# Altium project TB-S5D5_v1.2.PrjPcb
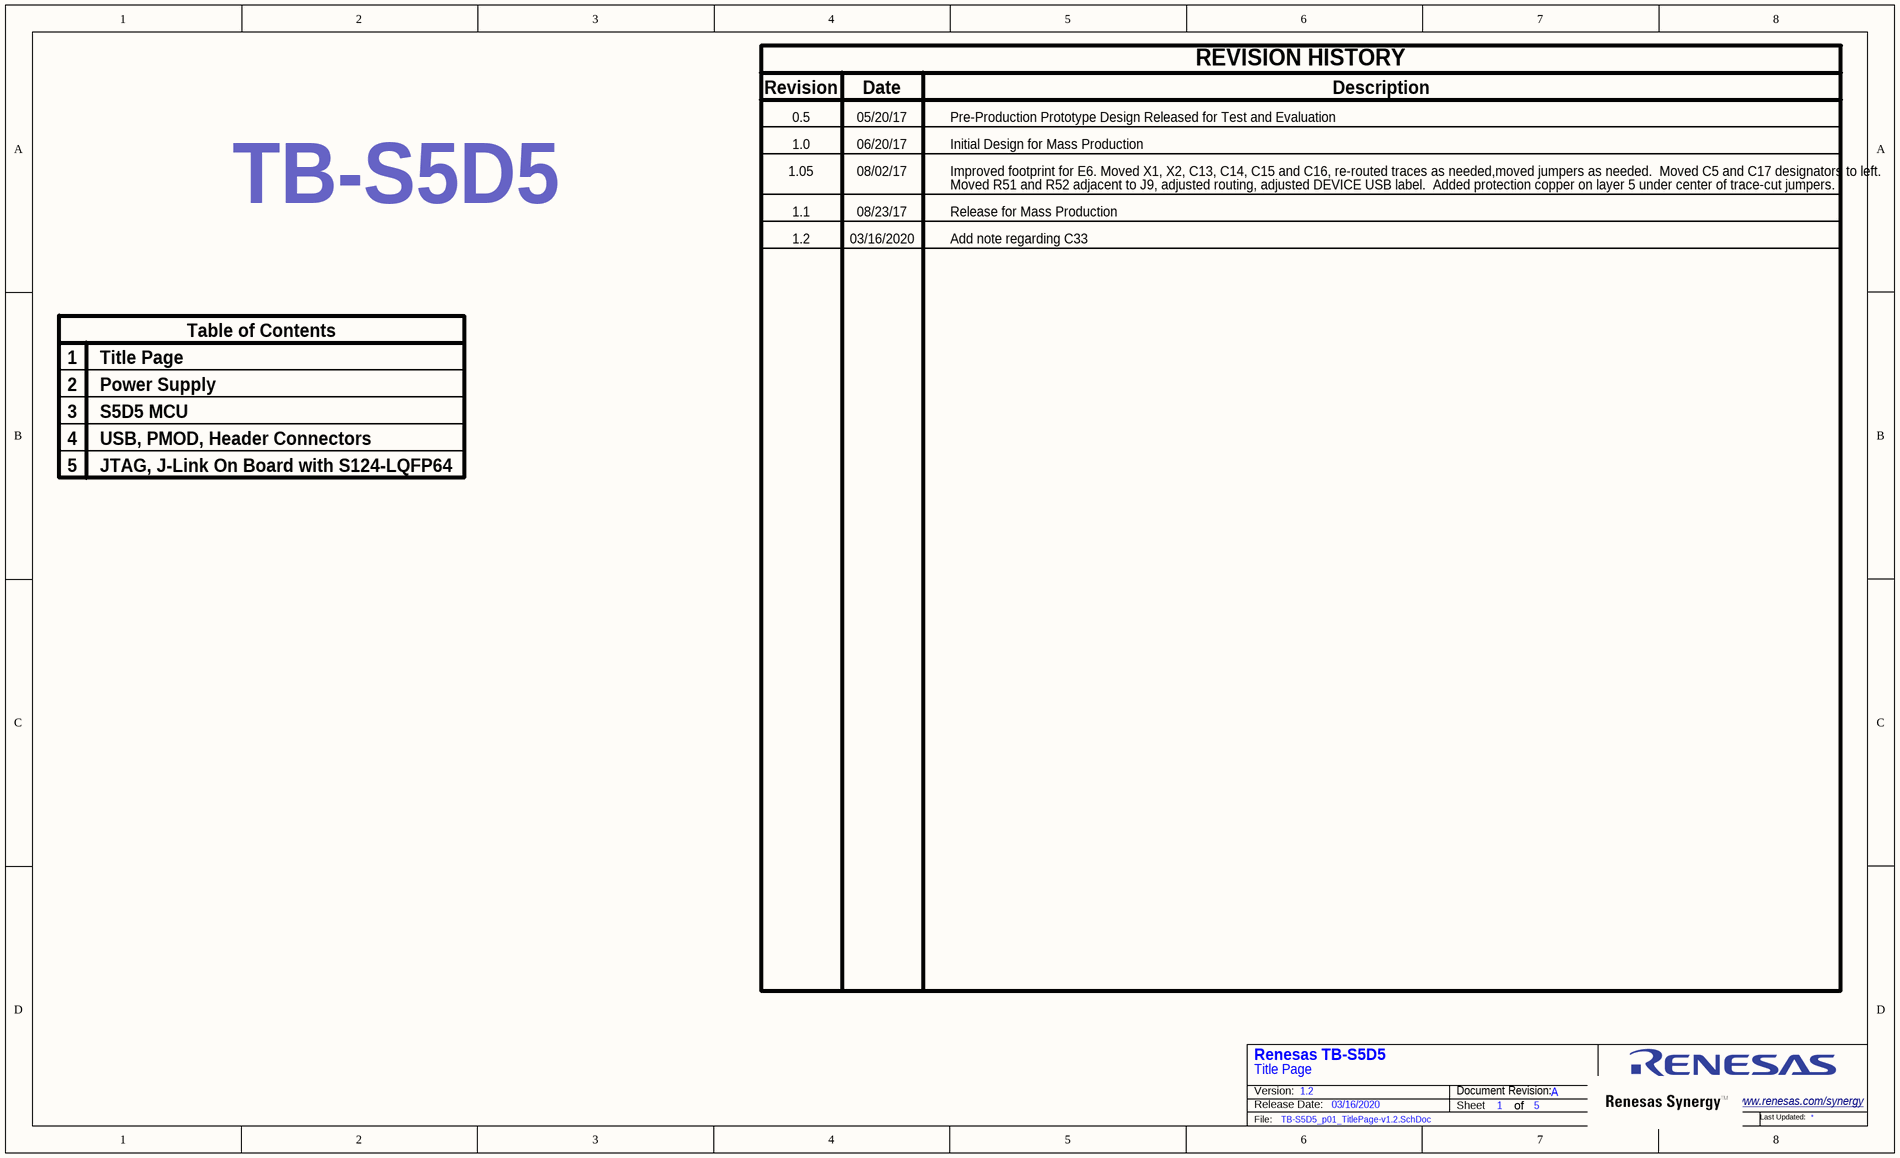
[diagram p0: TB-S5D5_p01_TitlePage-v1.2.SchDoc]
OUTFNAME_3DPDF: TB-S5D5_03-3D; OUTFNAME_OBOM: TB-S5D5_03_OutsideBOM; OUTFNAME_SCH: TB-S5D5_03; OUTFNAME_STEP: TB-S5D5_03-Model; PCB_REV: A; PCB_SPN: PCB-R01001-03; PCB_SYBD_PN: 00027; PROJECT_DATE: 03/16/2020; PROJECT_DESIG: TB-S5D5; PROJECT_DESIG_LC: tb-s5d5; PROJECT_NAME: Renesas TB-S5D5; PROJECT_VERSION: 1.2
5 sheets, 125 parts. Net scope: global (net labels, ports and power ports of the same name join across sheets).
Board file: TB-S5D5_v1.2.PcbDoc
Sheets:
  TB-S5D5_p01_TitlePage-v1.2.SchDoc
  TB-S5D5_p02_Power-v1.2.SchDoc
  TB-S5D5_p03_MCU-v1.2.SchDoc
  TB-S5D5_p04_Connectors-v1.2.SchDoc
  TB-S5D5_p05_JLink_OB-S124_QFP-v1.2.SchDoc

## Sheet TB-S5D5_p01_TitlePage-v1.2.SchDoc: Renesas DK-S3A7M
size Legal; Author: Jorge Amodio; Organization: Serious Integrated, Inc.; Address1: 145 s 79th Street; Address2: Suite 34; Address3: Chandler, AZ 85226; Address4: USA; DocumentNumber: 1; Revision: v2.0 PCB03; SheetNumber: 1; SheetTotal: 5; CompanyURL: www.seriousintegrated.com; ReleaseDate: 8/4/2015; Company Name: Renesas Electronics America; PageSetup: Record=PageOptions|CenterHorizontal=True|CenterVertical=True|PrintScale=1.00|XCorrection=1.00|YCorrection=1.00|PrintKind=1|BorderSize=5000000|LeftOffset=0|BottomOffset=0|Orientation=2|PaperLength=1000|PaperWidth=1000|Scale=100|PaperSource=7|PrintQuality=-4|MediaType=1|DitherType=10|PaperKind=A5 148x210mm|PrintScaleMode=1

### Notes on the sheet
- Revision
- Date
- REVISION HISTORY
- Description
- 0.5
- 1.0
- 05/20/17
- 06/20/17
- Pre-Production Prototype Design Released for Test and Evaluation
- Initial Design for Mass Production
- TB-S5D5
- 1.05
- 1.1
- 08/02/17
- 08/23/17
- Improved footprint for E6. Moved X1, X2, C13, C14, C15 and C16, re-routed traces as needed,moved jumpers as needed.  Moved C5 and C17 designators to left.
- Moved R51 and R52 adjacent to J9, adjusted routing, adjusted DEVICE USB label.  Added protection copper on layer 5 under center of trace-cut jumpers.
- Release for Mass Production
- 1.2
- 03/16/2020
- Add note regarding C33
- 1
- Title Page
- Table of Contents
- 2
- 3
- Power Supply
- S5D5 MCU
- 4
- 5
- USB, PMOD, Header Connectors
- JTAG, J-Link On Board with S124-LQFP64
- Version:
- Release Date:
- Document Revision:
- Sheet
- of
- www.renesas.com/synergy <http://www.renesas.com/synergy>
- File:
- 60
- Last Updated:

## Sheet TB-S5D5_p02_Power-v1.2.SchDoc: Renesas AE-CAP1-S3 Target Board
size Legal; Author: Jorge Amodio; Organization: Serious Integrated, Inc.; Address1: 145 s 79th Street; Address2: Suite 34; Address3: Chandler, AZ 85226; Address4: USA; DocumentNumber: 2; Revision: PCB02; SheetNumber: 2; SheetTotal: 5; CompanyURL: www.seriousintegrated.com; ReleaseDate: 8/12/2016; Version: v1.1; Company Name: Renesas Electronics America; PageSetup: Record=PageOptions|CenterHorizontal=True|CenterVertical=True|PrintScale=1.00|XCorrection=1.00|YCorrection=1.00|PrintKind=1|BorderSize=5000000|LeftOffset=0|BottomOffset=0|Orientation=2|PaperLength=1000|PaperWidth=1000|Scale=100|PaperSource=7|PrintQuality=-4|MediaType=1|DitherType=10|PaperKind=A5 148x210mm|PrintScaleMode=1
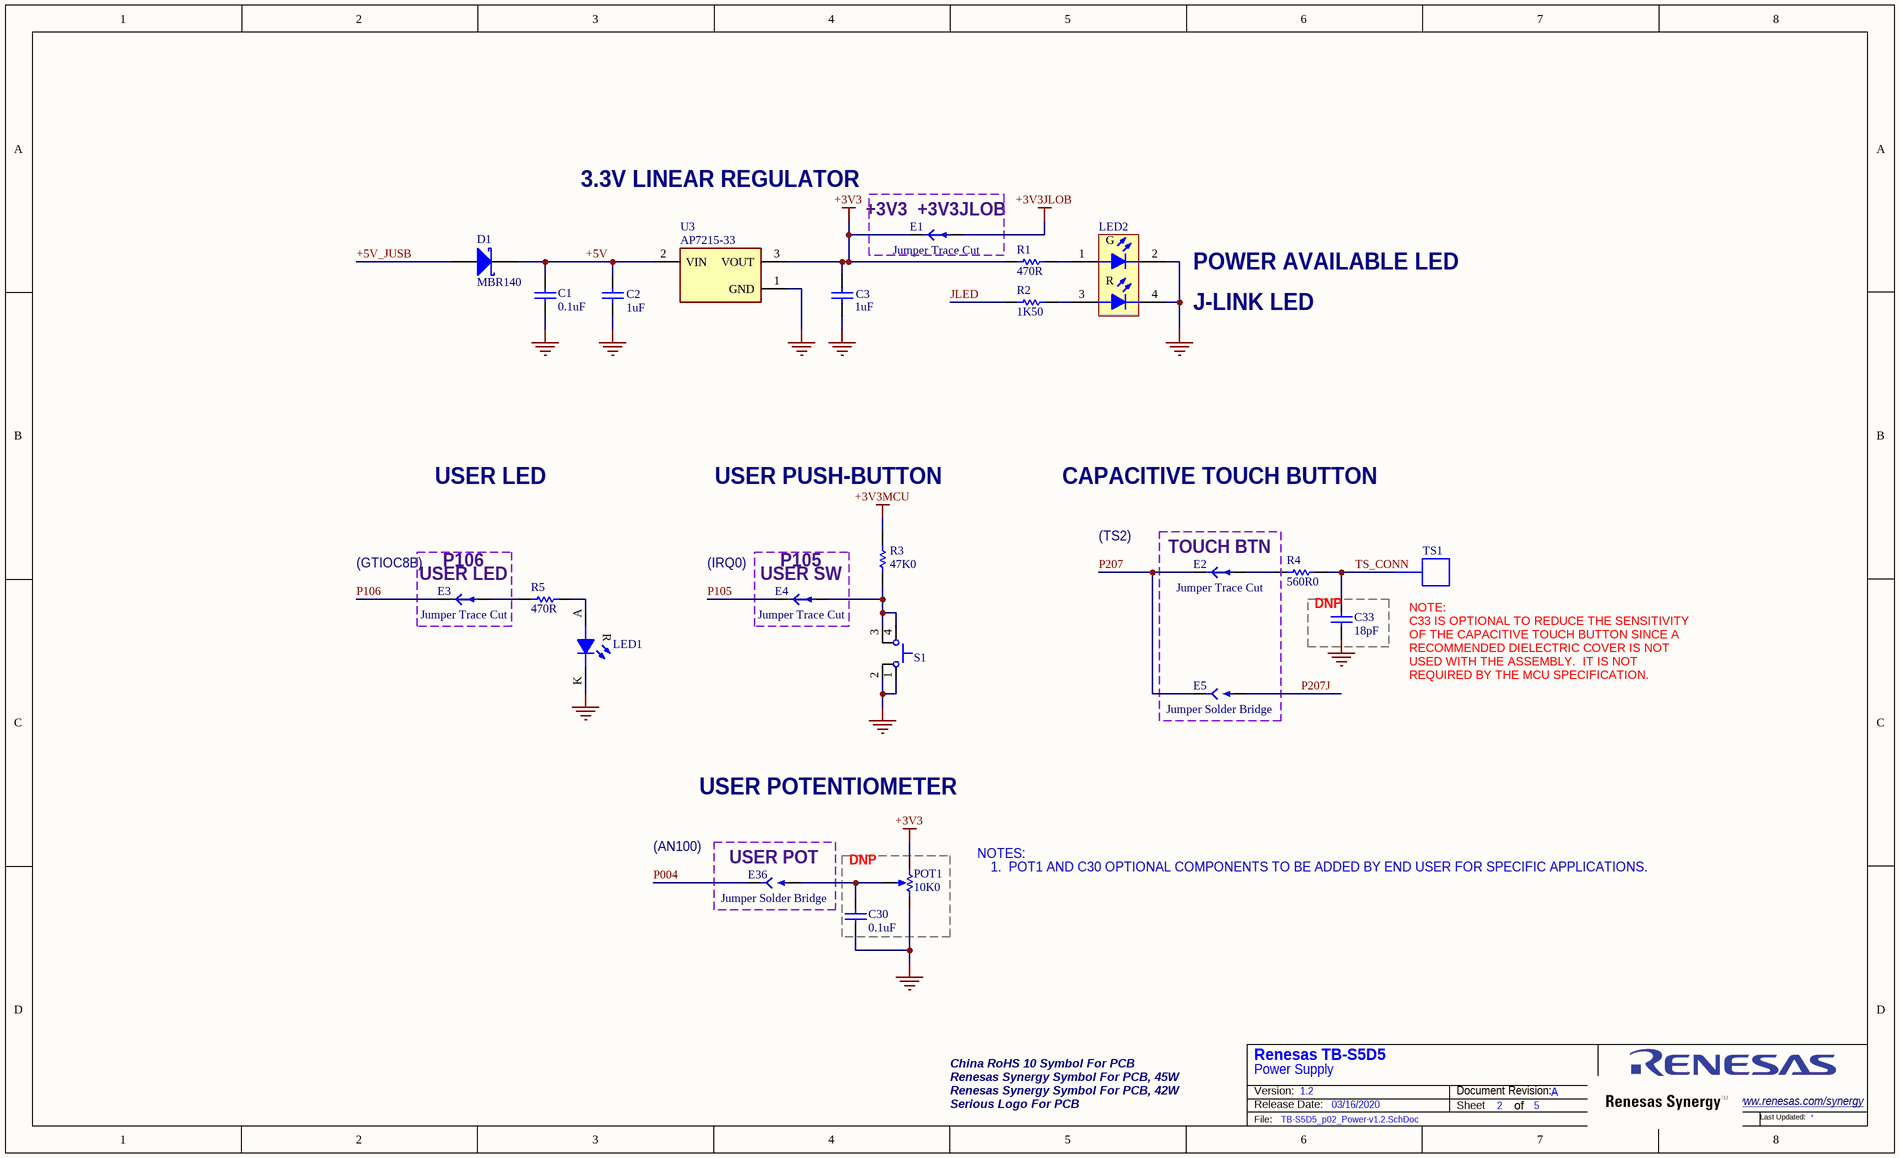
[diagram p1: TB-S5D5_p02_Power-v1.2.SchDoc]

### Parts
A_Logo1  This BOM is for Engineering Use Only, NOT FOR PURCHASE USE.  [_SeriousEngineering]  (value not drawn)
A_Symbol1  This Symbol Placed on PCB only.  [ChinaRoHS-7mm]  (value not drawn)  (no BOM)
A_Symbol2  This Symbol Placed on PCB only.  [RenesasSynergyLogo45x7]  (value not drawn)  (no BOM)
A_Symbol3  This Symbol Placed on PCB only.  [RenesasSynergyLogo42x7]  (value not drawn)  (no BOM)
C1  Capacitance: 0.1uF  [CAPC0603-01]  (hidden comment: CAP-000029-01)
C2  Capacitance: 1uF  [CAPC0402-01]  (hidden comment: CAP-000063-01)
C3  Capacitance: 1uF  [CAPC0402-01]  (hidden comment: CAP-000063-01)
C30  Capacitance: 0.1uF  [CAPC0603-01]  (hidden comment: CAP-000029-01)
C33  Capacitance: 18pF  [CAPC0603-01]  (hidden comment: CAP-000040-01)
D1  Display Name: MBR140  [ONSEMI_SOD-123LF]  (hidden comment: DIO-000012-01)
E1  Jumper Trace Cut  [E_PadsTraceCut0805]  (net tie, no BOM)
E2  Jumper Trace Cut  [E_PadsTraceCut0805]  (net tie, no BOM)
E3  Jumper Trace Cut  [E_PadsTraceCut0805]  (net tie, no BOM)
E4  Jumper Trace Cut  [E_PadsTraceCut0805]  (net tie, no BOM)
E5  Jumper Solder Bridge  [E_PadsSplit0805]  (no BOM)
E36  Jumper Solder Bridge  [E_PadsSplit0805]  (no BOM)
LED1  LED-000005-01  [LED_0603-RED]  (value not drawn)
LED2  LED-000001-01  [LED_DIALIGHT-598-8610]  (value not drawn)
POT1  Resistance: 10K0  [BOURNS_3352T]  (hidden comment: POT-000001-02)
R1  Resistance: 470R  [RESC0402-01]  (hidden comment: RES-000124-01)
R2  Resistance: 1K50  [RESC0402-01]  (hidden comment: RES-000140-01)
R3  Resistance: 47K0  [RESC0402-01]  (hidden comment: RES-000173-01)
R4  Resistance: 560R0  [RESC0603-01]  (hidden comment: RES-000206-01)
R5  Resistance: 470R  [RESC0402-01]  (hidden comment: RES-000124-01)
S1  SWT-000013-01  [SW_C&K_PTS645_43]  (value not drawn)
TS1  TOUCH_PAD_OL  [RENESAS_TSP_OL]  (value not drawn)  (no BOM)
U3  Display Name: AP7215-33  [SOT-89-3]  (hidden comment: ICN-000215-01)

### Blocks framed on the sheet
+3V3  +3V3JLOB: E1
TOUCH BTN: E2 E5
DNP: C33
USER POT: E36
DNP: C30 POT1

### Nets
+3V3: C3.2 E1.1(A) POT1.1 R1.1 U3.3(VOUT)
+3V3JLOB: E1.2(A)
+3V3MCU: R3.2
GND: C1.1 C2.1 C3.1 C30.1 C33.1 LED1.K LED2.2(K1) LED2.4(K2) POT1.3 S1.1 S1.2 U3.1(GND)
+5V: C1.2 C2.2 D1.K U3.2(VIN)
+5V_JUSB: D1.A
JLED: R2.1
P004: E36.1(A)
P105: E4.1(A)
P106: E3.1(A)
P207: E2.1(A) E5.1(A)
P207J: E5.2(A)
TS_CONN: C33.2 R4.2
NetC30_2: C30.2 E36.2(A) POT1.2
NetE2_2: E2.2(A) R4.1
NetE3_2: E3.2(A) R5.2
NetE4_2: E4.2(A) R3.1 S1.3 S1.4
NetLED1_A: LED1.A R5.1
NetLED2_1: LED2.1(A1) R1.2
NetLED2_3: LED2.3(A2) R2.2

### Notes on the sheet
- 3.3V LINEAR REGULATOR
- POWER AVAILABLE LED
- J-LINK LED
- USER LED
- USER PUSH-BUTTON
- CAPACITIVE TOUCH BUTTON
- (near E3) (GTIOC8B)
- (near E3) P106
- (near E4) (IRQ0)
- (near E4) P105
- (TS2)
- (near E3) USER LED
- (near E4) USER SW
- NOTE:
  C33 IS OPTIONAL TO REDUCE THE SENSITIVITY OF THE CAPACITIVE TOUCH BUTTON SINCE A RECOMMENDED DIELECTRIC COVER IS NOT USED WITH THE ASSEMBLY.  IT IS NOT REQUIRED BY THE MCU SPECIFICATION.
- USER POTENTIOMETER
- (AN100)
- NOTES:
- 1.  POT1 AND C30 OPTIONAL COMPONENTS TO BE ADDED BY END USER FOR SPECIFIC APPLICATIONS.
- Power Supply
- Version:
- Release Date:
- Document Revision:
- Sheet
- of
- www.renesas.com/synergy <http://www.renesas.com/synergy>
- File:
- 60
- Last Updated:
- (in symbol A_Serious_Engineering_Logo) Serious Logo For PCB
- (in symbol A_Symbol_ChinaRoHS07) China RoHS 10 Symbol For PCB
- (in symbol A_Symbol_RenesasSynergy-42x7) Renesas Synergy Symbol For PCB, 42W
- (in symbol A_Symbol_RenesasSynergy-45x7) Renesas Synergy Symbol For PCB, 45W
- (in symbol LED-000001-01) G; R
- (in symbol LED-000005-01) R

### Library data of the parts
A_Logo1 = A_Serious_Engineering_Logo: Combination disclaimer and Serious Integrated Design splash; Mfg Part Number: (none); Manufacturer: N/A
A_Symbol1 = A_Symbol_ChinaRoHS07: China RoHs Symbol Circle-7
A_Symbol2 = A_Symbol_RenesasSynergy-45x7: Renesas Synergy Logo, Std 45Wx7.4Hmm
A_Symbol3 = A_Symbol_RenesasSynergy-42x7: Renesas Synergy Logo, 42Wx6.8Hmm
C1 C30 = CAP-000029-01: Ceramic Chip Capacitor 0603 0.1uF 50V; Manufacturer: Samsung; Mfg Part Number: CL10B104KB8NNNC; Dialectric: X7R; Tolerance: 10%; Voltage: 50V; Package: 0603
C2 C3 = CAP-000063-01: Ceramic Chip Capacitor 0402 1uF 16V; Manufacturer: Samsung; Mfg Part Number: CL05A105KO5NNNC; Dialectric: X5R; Tolerance: 10%; Voltage: 16V; Package: 0402
C33 = CAP-000040-01: Ceramic Chip Capacitor 0603 18pF 50V; Manufacturer: Samsung; Mfg Part Number: CL10C180JB8NNNC; Dialectric: COG; Tolerance: 5%; Voltage: 50V; Package: 0603
D1 = DIO-000012-01: OnSemi Schottky Power Rectifier 40V 1A; Mfg Part Number: MBR140SFT1G; Manufacturer: OnSemi; Package: SOD-123FL; Voltage: 40V; Current: 1A
E1-E4 = E_JmpTraceCut: Pads on PCB with Trace Between for Cutting to isolate
E5 E36 = E_JmpSldrBridge: Pads on PCB with Narrow Gap to allow Solder Bridging
LED1 = LED-000005-01: Lite-On LED Red Clear 0603; Mfg Part Number: LTST-C191KRKT; Manufacturer: Lite-On; Package: 0603
LED2 = LED-000001-01: Dialight Bicolor LED Red/Green 1210; Mfg Part Number: 598-8610-207F; Manufacturer: Dialight; Package: 1210
POT1 = POT-000001-02: Bourns Single Turn Trimmer 10K0; Mfg Part Number: 3352T-1-103LF; Tolerance: 20%; Package: BOURNS_3355T; Manufacturer: Bourns
R1 R5 = RES-000124-01: Chip Resistor Thick Film 0402 470R 0.5% 1/16W; Manufacturer: Panasonic; Mfg Part Number: ERA-2AED471X; Package: 0402; Power: 1/16W; Tolerance: 0.5%
R2 = RES-000140-01: Chip Resistor Thick Film 0402 1K50 0.5% 1/16W; Manufacturer: Panasonic; Mfg Part Number: ERA-2AED152X; Package: 0402; Power: 1/16W; Tolerance: 0.5%
R3 = RES-000173-01: Chip Resistor Thick Film 0402 47K0 1% 1/10W; Manufacturer: Panasonic; Mfg Part Number: ERJ-2RKF4702X; Package: 0402; Power: 1/10W; Tolerance: 1%
R4 = RES-000206-01: Chip Resistor Thick Film 0603 560R0 1% 1/10W; Manufacturer: Panasonic; Mfg Part Number: ERJ-3EKF5600V; Package: 0603; Power: 1/10W; Tolerance: 1%; Serious P/N: RES-000206-01
S1 = SWT-000013-01: Push Button Switch 6 x 6mm 4.3mm High; Manufacturer: C&K; Mfg Part Number: PTS645SM43SMTR92 LFS; Serious P/N: SWT-000013-01
TS1 = TOUCH_PAD_OL: Renesas Touch Sense Pad Outline (for non-Pad use)
U3 = ICN-000215-01: LDO Regulator 3.3V 600mA; Manufacturer: Diodes; Mfg Part Number: AP7215-33YG-13; Package: SOT-89-3

## Sheet TB-S5D5_p03_MCU-v1.2.SchDoc: Renesas AE-CAP1-S3 Target Board
size Legal; Author: Jorge Amodio; Organization: Serious Integrated, Inc.; Address1: 145 s 79th Street; Address2: Suite 34; Address3: Chandler, AZ 85226; Address4: USA; DocumentNumber: 3; Revision: PCB02; SheetNumber: 3; SheetTotal: 5; CompanyURL: www.seriousintegrated.com; ReleaseDate: 8/12/2016; Version: v1.1; Company Name: Renesas Electronics America; PageSetup: Record=PageOptions|CenterHorizontal=True|CenterVertical=True|PrintScale=1.00|XCorrection=1.00|YCorrection=1.00|PrintKind=1|BorderSize=5000000|LeftOffset=0|BottomOffset=0|Orientation=2|PaperLength=1000|PaperWidth=1000|Scale=100|PaperSource=7|PrintQuality=-4|MediaType=1|DitherType=10|PaperKind=A5 148x210mm|PrintScaleMode=1
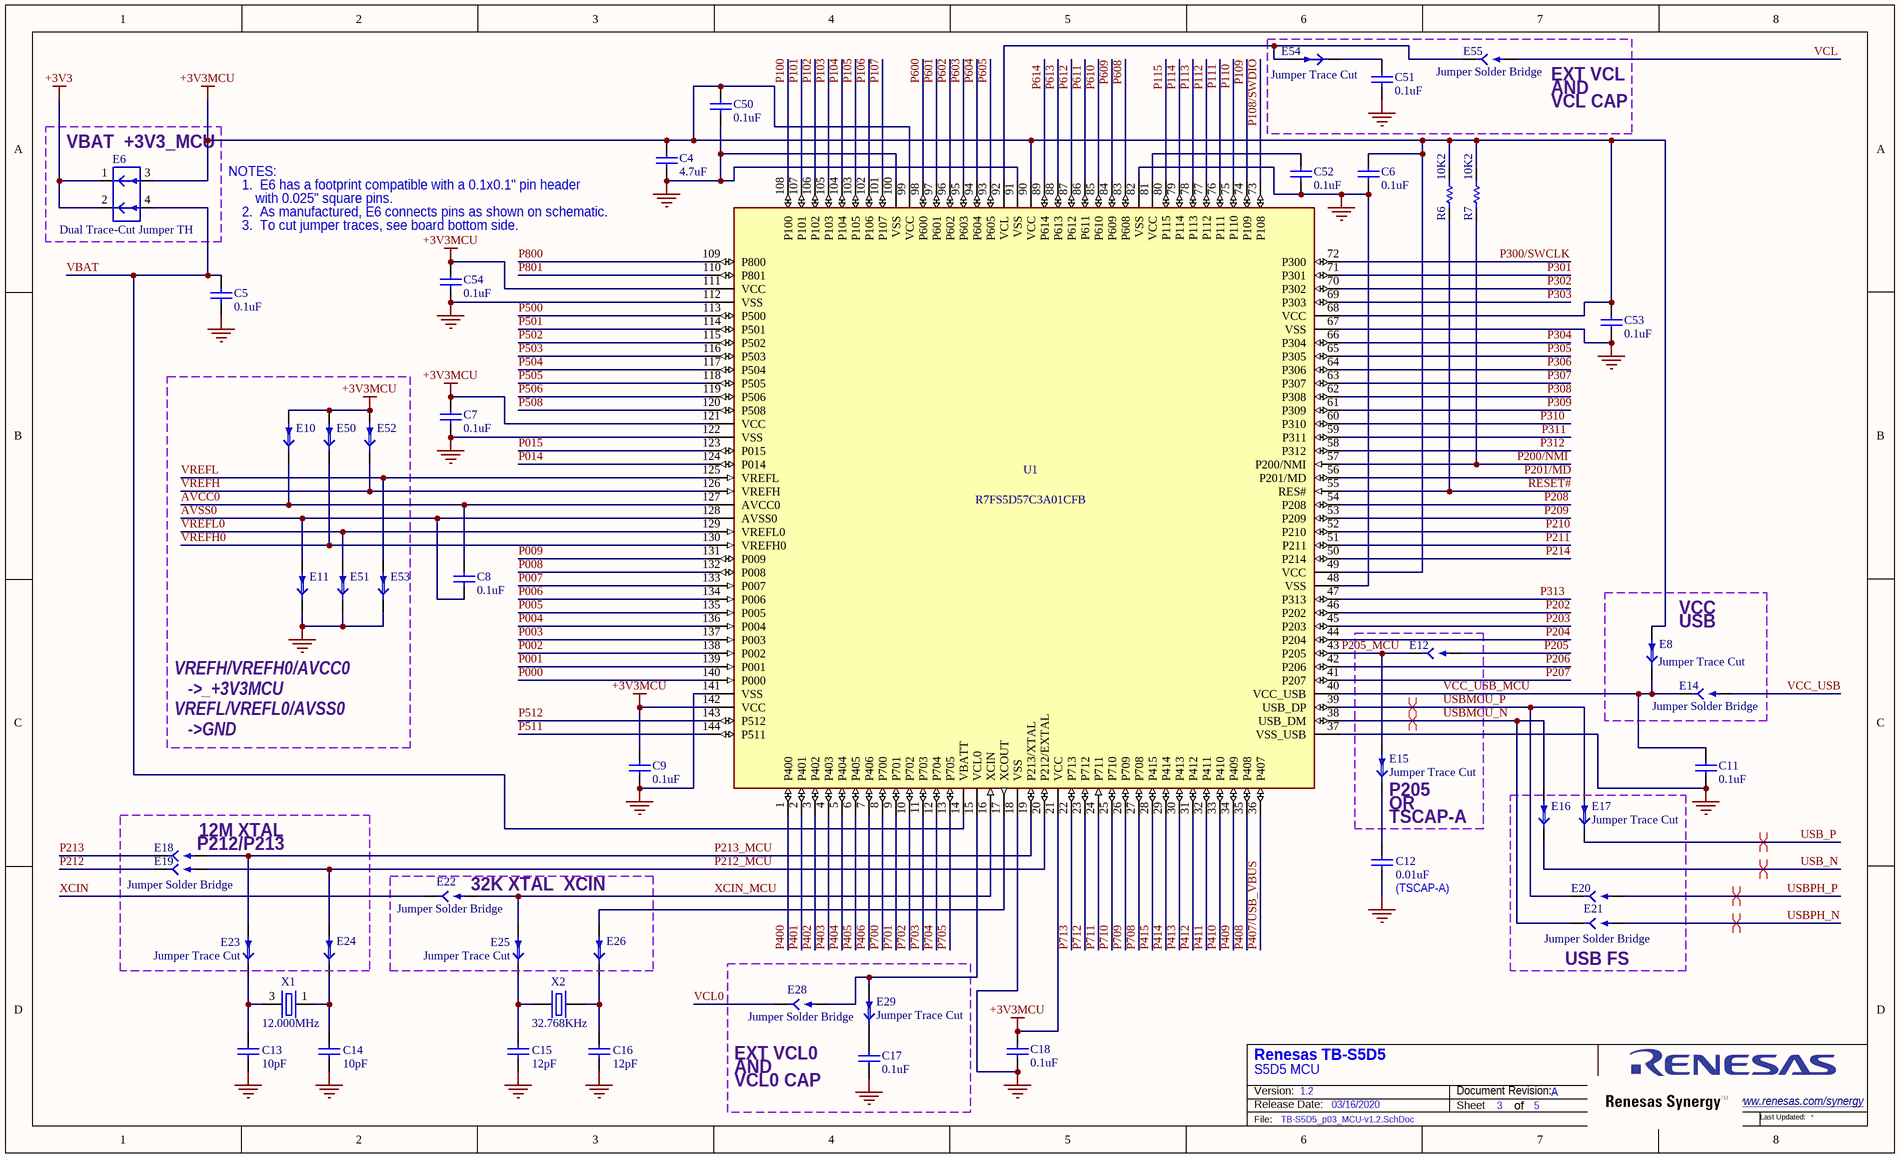
[diagram p2: TB-S5D5_p03_MCU-v1.2.SchDoc]

### Parts
C4  Capacitance: 4.7uF  [CAPC0603-01]  (hidden comment: CAP-000043-01)
C5  Capacitance: 0.1uF  [CAPC0603-01]  (hidden comment: CAP-000029-01)
C6  Capacitance: 0.1uF  [CAPC0603-01]  (hidden comment: CAP-000029-01)
C7  Capacitance: 0.1uF  [CAPC0603-01]  (hidden comment: CAP-000029-01)
C8  Capacitance: 0.1uF  [CAPC0603-01]  (hidden comment: CAP-000029-01)
C9  Capacitance: 0.1uF  [CAPC0603-01]  (hidden comment: CAP-000029-01)
C11  Capacitance: 0.1uF  [CAPC0603-01]  (hidden comment: CAP-000029-01)
C12  Capacitance: 0.01uF  [CAPC0402-01]  (hidden comment: CAP-000062-01)
C13  Capacitance: 10pF  [CAPC0201-01]  (hidden comment: CAP-000081-01)
C14  Capacitance: 10pF  [CAPC0201-01]  (hidden comment: CAP-000081-01)
C15  Capacitance: 12pF  [CAPC0402-01]  (hidden comment: CAP-000059-01)
C16  Capacitance: 12pF  [CAPC0402-01]  (hidden comment: CAP-000059-01)
C17  Capacitance: 0.1uF  [CAPC0603-01]  (hidden comment: CAP-000029-01)
C18  Capacitance: 0.1uF  [CAPC0603-01]  (hidden comment: CAP-000029-01)
C50  Capacitance: 0.1uF  [CAPC0603-01]  (hidden comment: CAP-000029-01)
C51  Capacitance: 0.1uF  [CAPC0603-01]  (hidden comment: CAP-000029-01)
C52  Capacitance: 0.1uF  [CAPC0603-01]  (hidden comment: CAP-000029-01)
C53  Capacitance: 0.1uF  [CAPC0603-01]  (hidden comment: CAP-000029-01)
C54  Capacitance: 0.1uF  [CAPC0603-01]  (hidden comment: CAP-000029-01)
E6  Dual Trace-Cut Jumper TH  [E_2x2pTH-TC100mil]  (net tie, no BOM)
E8  Jumper Trace Cut  [E_PadsTraceCut0805]  (net tie, no BOM)
E10  Jumper Trace Cut  [E_PadsTraceCut0805]  (value not drawn)  (net tie, no BOM)
E11  Jumper Trace Cut  [E_PadsTraceCut0805]  (value not drawn)  (net tie, no BOM)
E12  Jumper Solder Bridge  [E_PadsSplit0805]  (value not drawn)  (no BOM)
E14  Jumper Solder Bridge  [E_PadsSplit0805]  (no BOM)
E15  Jumper Trace Cut  [E_PadsTraceCut0805]  (net tie, no BOM)
E16  Jumper Trace Cut  [E_PadsTraceCut0805]  (value not drawn)  (net tie, no BOM)
E17  Jumper Trace Cut  [E_PadsTraceCut0805]  (net tie, no BOM)
E18  Jumper Solder Bridge  [E_PadsSplit0805]  (value not drawn)  (no BOM)
E19  Jumper Solder Bridge  [E_PadsSplit0805]  (no BOM)
E20  Jumper Solder Bridge  [E_PadsSplit0805]  (value not drawn)  (no BOM)
E21  Jumper Solder Bridge  [E_PadsSplit0805]  (no BOM)
E22  Jumper Solder Bridge  [E_PadsSplit0805]  (no BOM)
E23  Jumper Trace Cut  [E_PadsTraceCut0805]  (net tie, no BOM)
E24  Jumper Trace Cut  [E_PadsTraceCut0805]  (value not drawn)  (net tie, no BOM)
E25  Jumper Trace Cut  [E_PadsTraceCut0805]  (net tie, no BOM)
E26  Jumper Trace Cut  [E_PadsTraceCut0805]  (value not drawn)  (net tie, no BOM)
E28  Jumper Solder Bridge  [E_PadsSplit0805]  (no BOM)
E29  Jumper Trace Cut  [E_PadsTraceCut0805]  (net tie, no BOM)
E50  Jumper Trace Cut  [E_PadsTraceCut0805]  (value not drawn)  (net tie, no BOM)
E51  Jumper Trace Cut  [E_PadsTraceCut0805]  (value not drawn)  (net tie, no BOM)
E52  Jumper Trace Cut  [E_PadsTraceCut0805]  (value not drawn)  (net tie, no BOM)
E53  Jumper Trace Cut  [E_PadsTraceCut0805]  (value not drawn)  (net tie, no BOM)
E54  Jumper Trace Cut  [E_PadsTraceCut0805]  (net tie, no BOM)
E55  Jumper Solder Bridge  [E_PadsSplit0805]  (no BOM)
R6  Resistance: 10K2  [RESC0603-01]  (hidden comment: RES-000091-01)
R7  Resistance: 10K2  [RESC0603-01]  (hidden comment: RES-000091-01)
U1  Display Name: R7FS5D57C3A01CFB  [RENESAS_PLQP0144KA-B_N]  (hidden comment: ICN-R01001-01)
X1  Frequency: 12.000MHz  [TXC_7V]  (hidden comment: XTL-000011-01)
X2  Frequency: 32.768KHz  [ABRACON_ABS07]  (hidden comment: XTL-000006-01)

### Blocks framed on the sheet
VBAT  +3V3_MCU: E6
USB FS: E16 E17 E20 E21
32K XTAL  XCIN: E22 E25 E26

### Nets
+3V3: E6.1(A1) E6.2(A2)
+3V3MCU: C4.2 C6.1 C7.1 C9.1 C18.1 C50.1 C53.1 C54.1 E6.3(B1) E8.2(A) E10.2(A) E50.2(A) E52.2(A) R6.2 R7.2 U1.21(VCC) U1.49(VCC) U1.68(VCC) U1.90(VCC) U1.99(VCC) U1.111(VCC) U1.121(VCC) U1.142(VCC)
GND: C4.1 C5.2 C6.2 C7.2 C9.2 C11.2 C12.1 C13.1 C14.1 C15.1 C16.1 C17.2 C18.2 C50.2 C51.2 C52.2 C53.2 C54.2 E11.1(A) E51.1(A) E53.1(A) U1.18(VSS) U1.37(VSS_USB) U1.48(VSS) U1.67(VSS) U1.82(VSS) U1.91(VSS) U1.100(VSS) U1.112(VSS) U1.122(VSS) U1.141(VSS)
AVCC0: C8.1 E10.1(A) U1.127(AVCC0)
AVSS0: C8.2 E11.2(A) U1.128(AVSS0)
P000: U1.140(P000)
P001: U1.139(P001)
P002: U1.138(P002)
P003: U1.137(P003)
P004: U1.136(P004)
P005: U1.135(P005)
P006: U1.134(P006)
P007: U1.133(P007)
P008: U1.132(P008)
P009: U1.131(P009)
P014: U1.124(P014)
P015: U1.123(P015)
P100: U1.108(P100)
P101: U1.107(P101)
P102: U1.106(P102)
P103: U1.105(P103)
P104: U1.104(P104)
P105: U1.103(P105)
P106: U1.102(P106)
P107: U1.101(P107)
P108/SWDIO: U1.73(P108)
P109: U1.74(P109)
P110: U1.75(P110)
P111: U1.76(P111)
P112: U1.77(P112)
P113: U1.78(P113)
P114: U1.79(P114)
P115: U1.80(P115)
P200/NMI: R7.1 U1.57(P200/NMI)
P201/MD: U1.56(P201/MD)
P202: U1.46(P202)
P203: U1.45(P203)
P204: U1.44(P204)
P205: E12.2(A)
P205_MCU: E12.1(A) E15.2(A) U1.43(P205)
P206: U1.42(P206)
P207: U1.41(P207)
P208: U1.54(P208)
P209: U1.53(P209)
P210: U1.52(P210)
P211: U1.51(P211)
P212: E19.1(A)
P212_MCU: E19.2(A) E24.2(A) U1.20(P212/EXTAL)
P213: E18.1(A)
P213_MCU: E18.2(A) E23.2(A) U1.19(P213/XTAL)
P214: U1.50(P214)
P300/SWCLK: U1.72(P300)
P301: U1.71(P301)
P302: U1.70(P302)
P303: U1.69(P303)
P304: U1.66(P304)
P305: U1.65(P305)
P306: U1.64(P306)
P307: U1.63(P307)
P308: U1.62(P308)
P309: U1.61(P309)
P310: U1.60(P310)
P311: U1.59(P311)
P312: U1.58(P312)
P313: U1.47(P313)
P400: U1.1(P400)
P401: U1.2(P401)
P402: U1.3(P402)
P403: U1.4(P403)
P404: U1.5(P404)
P405: U1.6(P405)
P406: U1.7(P406)
P407/USB_VBUS: U1.36(P407)
P408: U1.35(P408)
P409: U1.34(P409)
P410: U1.33(P410)
P411: U1.32(P411)
P412: U1.31(P412)
P413: U1.30(P413)
P414: U1.29(P414)
P415: U1.28(P415)
P500: U1.113(P500)
P501: U1.114(P501)
P502: U1.115(P502)
P503: U1.116(P503)
P504: U1.117(P504)
P505: U1.118(P505)
P506: U1.119(P506)
P508: U1.120(P508)
P511: U1.144(P511)
P512: U1.143(P512)
P600: U1.98(P600)
P601: U1.97(P601)
P602: U1.96(P602)
P603: U1.95(P603)
P604: U1.94(P604)
P605: U1.93(P605)
P608: U1.83(P608)
P609: U1.84(P609)
P610: U1.85(P610)
P611: U1.86(P611)
P612: U1.87(P612)
P613: U1.88(P613)
P614: U1.89(P614)
P700: U1.8(P700)
P701: U1.9(P701)
P702: U1.10(P702)
P703: U1.11(P703)
P704: U1.12(P704)
P705: U1.13(P705)
P708: U1.27(P708)
P709: U1.26(P709)
P710: U1.25(P710)
P711: U1.24(P711)
P712: U1.23(P712)
P713: U1.22(P713)
P800: U1.109(P800)
P801: U1.110(P801)
RESET#: R6.1 U1.55(RES#)
USB_N: E16.1(A)
USB_P: E17.1(A)
USBMCU_N: E16.2(A) E21.1(A) U1.38(USB_DM)
USBMCU_P: E17.2(A) E20.1(A) U1.39(USB_DP)
USBPH_N: E21.2(A)
USBPH_P: E20.2(A)
VBAT: C5.1 E6.4(B2) U1.14(VBATT)
VCC_USB: E14.2(A)
VCC_USB_MCU: C11.1 E8.1(A) E14.1(A) U1.40(VCC_USB)
VCL: E55.2(A)
VCL0: E28.1(A)
VREFH: E52.1(A) U1.126(VREFH)
VREFH0: E50.1(A) U1.130(VREFH0)
VREFL: E53.2(A) U1.125(VREFL)
VREFL0: E51.2(A) U1.129(VREFL0)
XCIN: E22.1(A)
XCIN_MCU: E22.2(A) E25.2(A) U1.16(XCIN)
NetC12_2: C12.2 E15.1(A)
NetC13_2: C13.2 E23.1(A) X1.3
NetC14_2: C14.2 E24.1(A) X1.1
NetC15_2: C15.2 E25.1(A) X2.1
NetC16_2: C16.2 E26.1(A) X2.2
NetC17_1: C17.1 E29.1(A)
NetC51_1: C51.1 E54.1(A)
NetC52_1: C52.1 U1.81(VCC)
NetE26_2: E26.2(A) U1.17(XCOUT)
NetE28_2: E28.2(A) E29.2(A) U1.15(VCL0)
NetE54_2: E54.2(A) E55.1(A) U1.92(VCL)

### Layout directives
differential pair: USB_N, USB_P, USBMCU_N, USBMCU_P, USBPH_N, USBPH_P

### Notes on the sheet
- (near E55) EXT VCL
- (near E55) AND
- VCL CAP
- NOTES:
- (near C4) 1.  E6 has a footprint compatible with a 0.1x0.1" pin header
- 2.  As manufactured, E6 connects pins as shown on schematic.
- 3.  To cut jumper traces, see board bottom side.
- with 0.025" square pins.
- (near E8) VCC
- (near E8) USB
- VREFH/VREFH0/AVCC0
- ->_+3V3MCU
- VREFL/VREFL0/AVSS0
- ->GND
- (near E18) 12M XTAL
- (near E15) P205
- TSCAP-A
- (near E15) OR
- (near E18) P212/P213
- (near C12) (TSCAP-A)
- EXT VCL0
- AND
- VCL0 CAP
- S5D5 MCU
- Version:
- Release Date:
- Document Revision:
- Sheet
- of
- www.renesas.com/synergy <http://www.renesas.com/synergy>
- File:
- 60
- Last Updated:

### Library data of the parts
C4 = CAP-000043-01: Ceramic Chip Capacitor 0603 4.7uF 6.3V; Manufacturer: Samsung; Mfg Part Number: CL10A475KQ8NNNL; Dialectric: X5R; Tolerance: 10%; Voltage: 6.3V; Package: 0603
C5-C9 C11 C17 C18 C50-C54 = CAP-000029-01: as C1 on sheet TB-S5D5_p02_Power-v1.2; Voltage: 50V; Package: 0603
C12 = CAP-000062-01: Ceramic Chip Capacitor 0402 0.01uF 50V; Manufacturer: Samsung; Mfg Part Number: CL05B103KB5NNNC; Dialectric: X7R; Tolerance: 10%; Voltage: 50V; Package: 0402
C13 C14 = CAP-000081-01: Ceramic Chip Capacitor 0201 10pF 25V; Manufacturer: Samsung; Mfg Part Number: CL03C100DA3GNNC; Dialectric: C0G; Tolerance: 10%; Voltage: 25V; Package: 0201
C15 C16 = CAP-000059-01: Ceramic Chip Capacitor 0402 12pF 50V; Manufacturer: Samsung; Mfg Part Number: CL05C120JB5NNNC; Dialectric: COG; Tolerance: 5%; Voltage: 50V; Package: 0402
E6 = E_JmpTCx2: Trace-Cut Jumper pair, pins 1->3 & 2->4 connected
E8 E10 E11 E15-E17 E23-E26 E29 E50-E54 = E_JmpTraceCut: as E1 on sheet TB-S5D5_p02_Power-v1.2
E12 E14 E18-E22 E28 E55 = E_JmpSldrBridge: as E5 on sheet TB-S5D5_p02_Power-v1.2
R6 R7 = RES-000091-01: Chip Resistor Thick Film 0603 10K2 1% 1/10W; Manufacturer: NIC; Mfg Part Number: NRC06F1022TRF; Package: 0603; Power: 1/10W; Tolerance: 1%
U1 = ICN-R01001-01: Renesas S5D5 ARM Cortex M4 120MHz MCU LQFP144; Mfg Part Number: R7FS5D57C3A01CFB#AA0; Architecture: ARM Ctx M4; CAN: 1; FLASH DATA: 32KB; FLASH CODE: 1MB; RAM: 352KB; Manufacturer: Renesas; Max Clock Speed: 120MHz; Package: LQFP-144
X1 = XTL-000011-01: Crystal 12MHz 10pF; Manufacturer: Abracon; Mfg Part Number: ABM8G-12.000MHZ-B4Y-T; Freq Stability: +/-20ppm; Load Capacitance: 10pF
X2 = XTL-000006-01: Crystal 32.769KHz 12.5pF SMT; Manufacturer: Abracon; Mfg Part Number: ABS07-32.768KHZ-T; Freq Stability: +/- 20ppm; Load Capacitance: 12.5pF

## Sheet TB-S5D5_p04_Connectors-v1.2.SchDoc: Renesas AE-CAP1-S3 Target Board
size Legal; Author: Jorge Amodio; Organization: Serious Integrated, Inc.; Address1: 145 s 79th Street; Address2: Suite 34; Address3: Chandler, AZ 85226; Address4: USA; DocumentNumber: 4; Revision: PCB02; SheetNumber: 4; SheetTotal: 5; CompanyURL: www.seriousintegrated.com; ReleaseDate: 8/12/2016; Version: v1.1; Company Name: Renesas Electronics America; PageSetup: Record=PageOptions|CenterHorizontal=True|CenterVertical=True|PrintScale=1.00|XCorrection=1.00|YCorrection=1.00|PrintKind=1|BorderSize=5000000|LeftOffset=0|BottomOffset=0|Orientation=2|PaperLength=1000|PaperWidth=1000|Scale=100|PaperSource=7|PrintQuality=-4|MediaType=1|DitherType=10|PaperKind=A5 148x210mm|PrintScaleMode=1
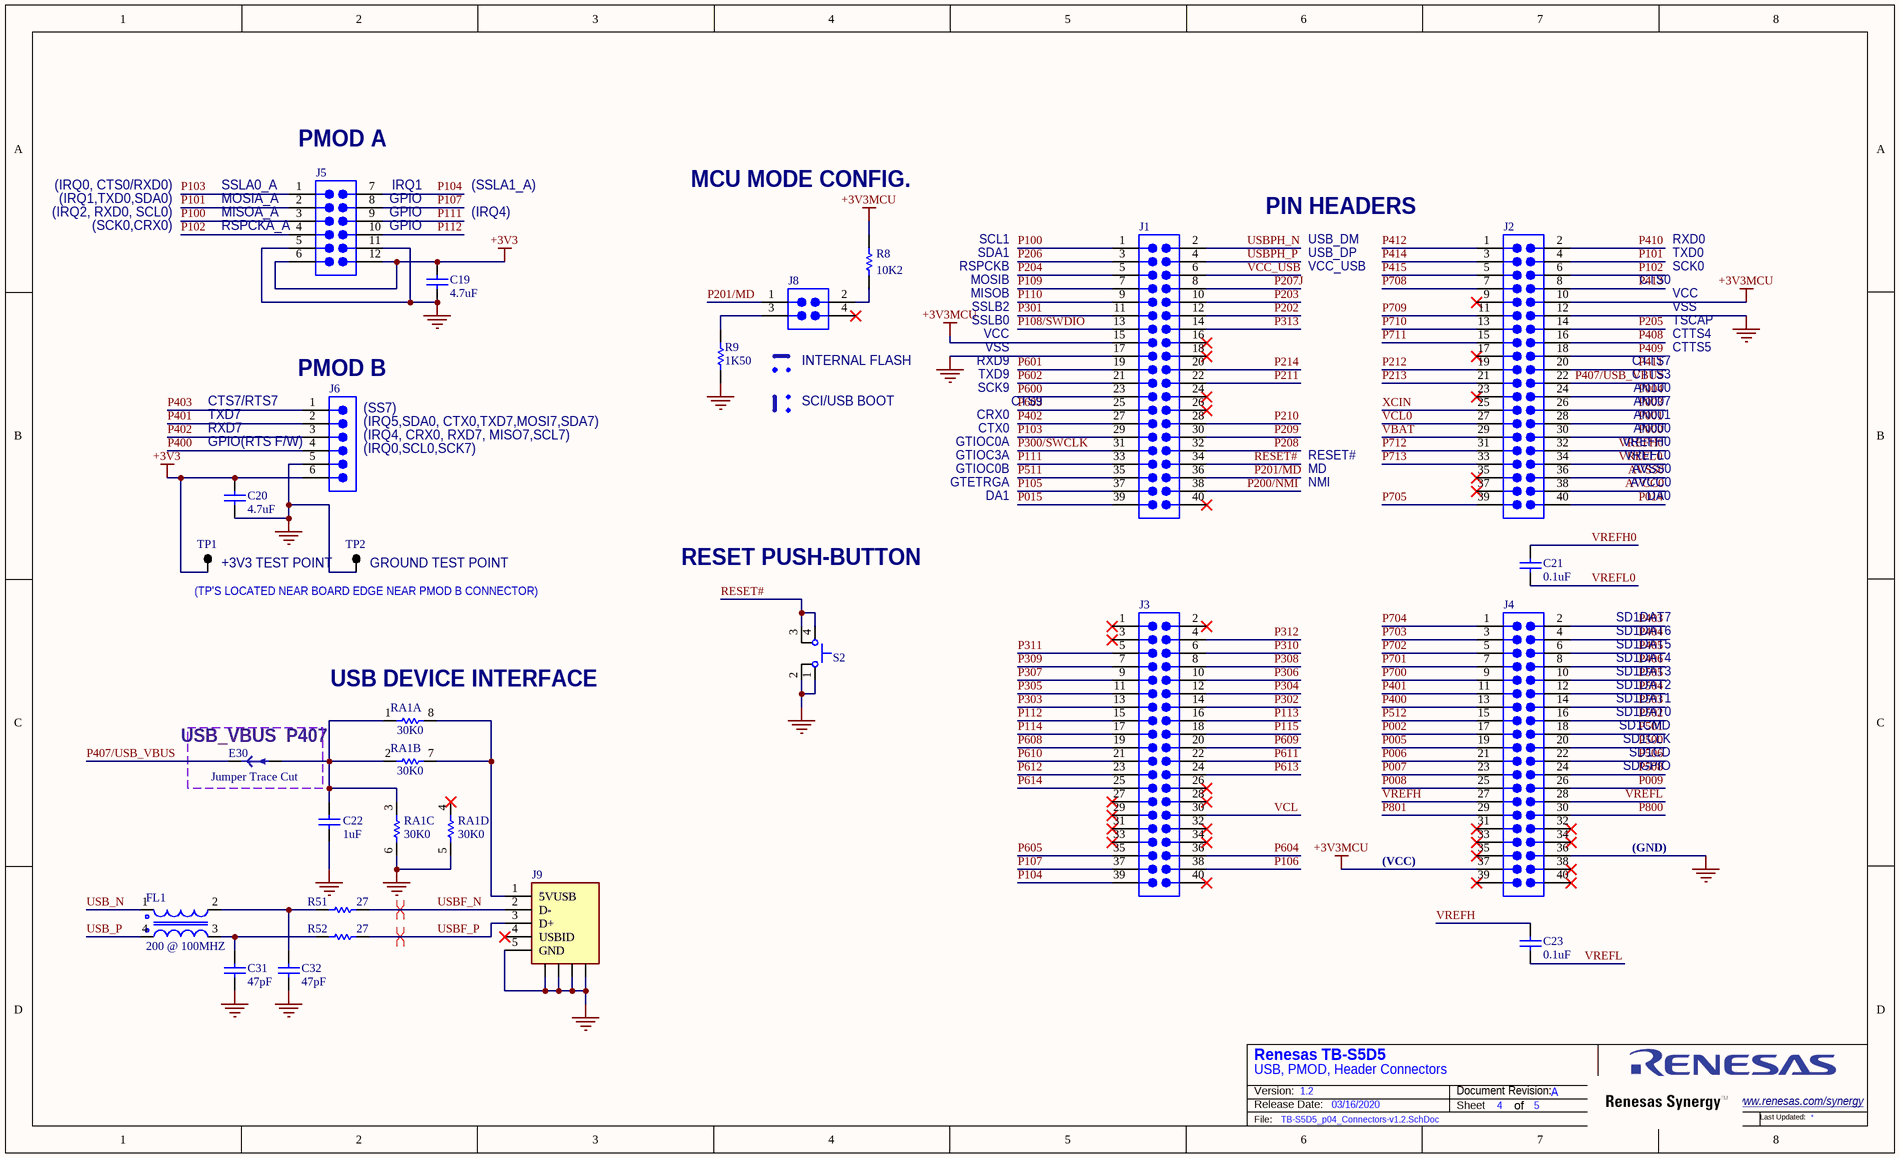
[diagram p3: TB-S5D5_p04_Connectors-v1.2.SchDoc]

### Parts
C19  Capacitance: 4.7uF  [CAPC0603-01]  (hidden comment: CAP-000043-01)
C20  Capacitance: 4.7uF  [CAPC0603-01]  (hidden comment: CAP-000043-01)
C21  Capacitance: 0.1uF  [CAPC0603-01]  (hidden comment: CAP-000029-01)
C22  Capacitance: 1uF  [CAPC0402-01]  (hidden comment: CAP-000063-01)
C23  Capacitance: 0.1uF  [CAPC0603-01]  (hidden comment: CAP-000029-01)
C31  Capacitance: 47pF  [CAPC0402-01]  (hidden comment: CAP-000127-01)
C32  Capacitance: 47pF  [CAPC0402-01]  (hidden comment: CAP-000127-01)
E30  Jumper Trace Cut  [E_PadsTraceCut0805]  (net tie, no BOM)
FL1  Resistance: 200 @ 100MHZ  [FL0504]  (hidden comment: IND-000027-01)
J1  CON-000109-A1  [J_2x20pHDR100mil]  (value not drawn)
J2  CON-000109-A1  [J_2x20pHDR100mil]  (value not drawn)
J3  CON-000109-A1  [J_2x20pHDR100mil]  (value not drawn)
J4  CON-000109-A1  [J_2x20pHDR100mil]  (value not drawn)
J5  CON-000050-01  [SAMTEC_SSW-106-02-F-D-RA-PMOD]  (value not drawn)
J6  CON-000148-01  [SAMTEC_SSW-106-02-F-S-RA]  (value not drawn)
J8  CON-000174-01  [FCI_77313-801-04LF]  (value not drawn)
J9  CON-000116-01  [FCI_10118192]  (value not drawn)
R8  Resistance: 10K2  [RESC0603-01]  (hidden comment: RES-000091-01)
R9  Resistance: 1K50  [RESC0402-01]  (hidden comment: RES-000140-01)
R51  Resistance: 27  [RESC0603-01]  (hidden comment: RES-R70620-01)
R52  Resistance: 27  [RESC0603-01]  (hidden comment: RES-R70620-01)
RA1  Resistance: 30K0  [RESCAF0804]  (hidden comment: RES-000117-01)  (parts A,B,C,D of 4)
S2  SWT-000013-01  [SW_C&K_PTS645_43]  (value not drawn)
TP1  Test Point  [TP_40milTHpad]  (value not drawn)  (no BOM)
TP2  Test Point  [TP_40milTHpad]  (value not drawn)  (no BOM)

### Blocks framed on the sheet
USB_VBUS  P407: E30

### Nets
+3V3: C19.2 C20.2 J5.6 J5.12 J6.6 TP1.1(TP)
+3V3MCU: J1.15 J2.10 J4.37 R8.2
GND: C19.1 C20.1 C22.1 C31.1 C32.1 J1.17 J2.12 J4.36 J5.5 J5.11 J6.5 J9.5(GND) J9.C1 J9.C2 J9.C3 J9.C4 R9.1 RA1.5 RA1.6 S2.1 S2.2 TP2.1(TP)
AVCC0: J2.38
AVSS0: J2.36
P000: J2.30
P001: J2.28
P002: J4.17
P003: J2.26
P004: J2.24
P005: J4.19
P006: J4.21
P007: J4.23
P008: J4.25
P009: J4.26
P014: J2.40
P015: J1.39
P100: J1.1 J5.3
P101: J2.4 J5.2
P102: J2.6 J5.4
P103: J1.29 J5.1
P104: J3.39 J5.7
P105: J1.37
P106: J3.38
P107: J3.37 J5.8
P108/SWDIO: J1.13
P109: J1.7
P110: J1.9
P111: J1.33 J5.9
P112: J3.15 J5.10
P113: J3.16
P114: J3.17
P115: J3.18
P200/NMI: J1.38
P201/MD: J1.36 J8.1
P202: J1.12
P203: J1.10
P204: J1.5
P205: J2.14
P206: J1.3
P207J: J1.8
P208: J1.32
P209: J1.30
P210: J1.28
P211: J1.22
P212: J2.19
P213: J2.21
P214: J1.20
P300/SWCLK: J1.31
P301: J1.11
P302: J3.14
P303: J3.13
P304: J3.12
P305: J3.11
P306: J3.10
P307: J3.9
P308: J3.8
P309: J3.7
P310: J3.6
P311: J3.5
P312: J3.4
P313: J1.14
P400: J4.13 J6.4
P401: J4.11 J6.2
P402: J1.27 J6.3
P403: J4.2 J6.1
P404: J4.4
P405: J4.6
P406: J4.8
P407/USB_VBUS: E30.1(A) J2.22
P408: J2.16
P409: J2.18
P410: J2.2
P411: J2.20
P412: J2.1
P413: J2.8
P414: J2.3
P415: J2.5
P500: J4.20
P501: J4.18
P502: J4.16
P503: J4.14
P504: J4.12
P505: J4.10
P506: J4.22
P508: J4.24
P511: J1.35
P512: J4.15
P600: J1.23
P601: J1.19
P602: J1.21
P603: J1.25
P604: J3.36
P605: J3.35
P608: J3.19
P609: J3.20
P610: J3.21
P611: J3.22
P612: J3.23
P613: J3.24
P614: J3.25
P700: J4.9
P701: J4.7
P702: J4.5
P703: J4.3
P704: J4.1
P705: J2.39
P708: J2.7
P709: J2.11
P710: J2.13
P711: J2.15
P712: J2.31
P713: J2.33
P800: J4.30
P801: J4.29
RESET#: J1.34 S2.3 S2.4
USB_N: FL1.1
USB_P: FL1.4
USBF_N: J9.2(D-) R51.2
USBF_P: J9.3(D+) R52.2
USBPH_N: J1.2
USBPH_P: J1.4
VBAT: J2.29
VCC_USB: J1.6
VCL: J3.30
VCL0: J2.27
VREFH: C23.2 J4.27
VREFH0: C21.2 J2.32
VREFL: C23.1 J4.28
VREFL0: C21.1 J2.34
XCIN: J2.25
NetC22_2: C22.2 E30.2(A) RA1.1 RA1.2 RA1.3
NetC31_2: C31.2 FL1.3 R52.1
NetC32_2: C32.2 FL1.2 R51.1
NetJ8_2: J8.2 R8.1
NetJ8_3: J8.3 R9.2
NetJ9_1: J9.1(5VUSB) RA1.7 RA1.8

Not connected (* = marked no-connect by the designer): J1 16* 18* 24* 26* 40*; J2 9* 17* 23* 35* 37*; J3 1* 2* 3* 26* 27* 28* 29* 31* 32* 33* 34* 40*; J4 31* 32* 33* 34* 35* 38* 39* 40*; J8 4*; J9 4(USBID)*; RA1 4*

### Layout directives
differential pair: USBF_N, USBF_P

### Notes on the sheet
- (near J5) PMOD A
- (IRQ0, CTS0/RXD0)
- (IRQ1,TXD0,SDA0)
- (IRQ2, RXD0, SCL0)
- (SCK0,CRX0)
- (near J5) SSLA0_A
- (near J5) MOSIA_A
- (near J5) MISOA_A
- (near J5) RSPCKA_A
- (near J5) IRQ1
- (near J5) GPIO
- GPIO
- (IRQ4)
- (SSLA1_A)
- MCU MODE CONFIG.
- PIN HEADERS
- SCL1
- SDA1
- RSPCKB
- MOSIB
- MISOB
- USB_DM
- USB_DP
- VCC_USB
- RXD0
- TXD0
- SCK0
- CTS0
- VCC
- (near J8) INTERNAL FLASH
- SSLB2
- SSLB0
- VSS
- RXD9
- TSCAP
- CTTS4
- CTTS5
- CTTS7
- CTS7/RTS7
- TXD7
- RXD7
- (near J6) PMOD B
- (near J6) (IRQ5,SDA0, CTX0,TXD7,MOSI7,SDA7)
- (near J6) (SS7)
- SCI/USB BOOT
- TXD9
- SCK9
- CTS9
- CRX0
- CTX0
- CTTS3
- AN100
- AN007
- AN001
- AN000
- GPIO(RTS F/W)
- (near J6) (IRQ0,SCL0,SCK7)
- (near J6) (IRQ4, CRX0, RXD7, MISO7,SCL7)
- GTIOC0A
- GTIOC3A
- GTIOC0B
- GTETRGA
- DA1
- RESET#
- MD
- NMI
- DA0
- VREFH0
- VREFL0
- AVSS0
- AVCC0
- (near TP1) +3V3 TEST POINT
- (near TP2) GROUND TEST POINT
- RESET PUSH-BUTTON
- (TP'S LOCATED NEAR BOARD EDGE NEAR PMOD B CONNECTOR)
- SD1DAT7
- SD1DAT6
- (near RA1) USB DEVICE INTERFACE
- SD1DAT5
- SD1DAT4
- SD1DAT3
- SD1DAT2
- SD1DAT1
- SD1DAT0
- SD1CMD
- SD1CLK
- SD1CD
- SDGPIO
- (VCC)
- (GND)
- USB, PMOD, Header Connectors
- Version:
- Release Date:
- Document Revision:
- Sheet
- of
- www.renesas.com/synergy <http://www.renesas.com/synergy>
- File:
- 60
- Last Updated:

### Library data of the parts
C19 C20 = CAP-000043-01: as C4 on sheet TB-S5D5_p03_MCU-v1.2; Voltage: 6.3V; Package: 0603
C21 C23 = CAP-000029-01: as C1 on sheet TB-S5D5_p02_Power-v1.2; Voltage: 50V; Package: 0603
C22 = CAP-000063-01: as C2 on sheet TB-S5D5_p02_Power-v1.2; Voltage: 16V; Package: 0402
C31 C32 = CAP-000127-01: Ceramic Chip Capacitor 0402 47pF 50V NP0/C0G; Manufacturer: Murata; Mfg Part Number: GRM1555C1H470JA01D; Dialectric: NP0; Tolerance: 5%; Voltage: 50V; Package: 0402
E30 = E_JmpTraceCut: as E1 on sheet TB-S5D5_p02_Power-v1.2
FL1 = IND-000027-01: Common Mode Filter Inductor, 200 ohm CM @ 100MHz; Manufacturer: Murata; Mfg Part Number: DLP11SN201HL2L; Current: 0.110A; Tolerance: 20%; Package: FL0504
J1-J4 = CON-000109-A1: Header 0.1" pitch 40pos 2x20, T<->B Inverted; Manufacturer: Sullins; Mfg Part Number: PRPC020DAAN-RC; Positions: 40; Pitch: 2.54mm
J5 = CON-000050-01_P: Samtec Female Header 0.1" pitch PMOD 2x6 Right Angle; Mfg Part Number: SSW-106-02-F-D-RA; Positions: 12; Pitch: 2.54mm; Manufacturer: Samtec
J6 = CON-000148-01: Samtec Female Header 0.1" pitch 6pos 1x6 Right Angle; Mfg Part Number: SSW-106-02-FM-S-RA; Positions: 6; Pitch: 2.54mm; Manufacturer: Samtec
J8 = CON-000174-01: FCI Header 0.1" pitch 4pos 2x2; Mfg Part Number: 67997-404HLF; Positions: 4; Pitch: 2.54mm; Manufacturer: FCI
J9 = CON-000116-01: USB Micro 2.0 Female 5 Pin Right Angle; Manufacturer: FCI; Mfg Part Number: 10118192-0001LF
R8 = RES-000091-01: as R6 on sheet TB-S5D5_p03_MCU-v1.2; Package: 0603; Power: 1/10W; Tolerance: 1%
R9 = RES-000140-01: as R2 on sheet TB-S5D5_p02_Power-v1.2; Package: 0402; Power: 1/16W; Tolerance: 0.5%
R51 R52 = RES-000210-01: Chip Resistor Thick Film 0603 27 5% 1/10W; Manufacturer: Stackpole; Mfg Part Number: RMCF0603JT27R0; Package: 0603; Power: 1/10W; Tolerance: 5%
RA1 = RES-000117-01: Chip Resistor Array 0804 30K0 5% 1/16W 4 x 0402; Manufacturer: Panasonic; Mfg Part Number: EXB-28V303JX; Package: 0804; Power: 1/16W; Tolerance: 5%
S2 = SWT-000013-01: as S1 on sheet TB-S5D5_p02_Power-v1.2; Serious P/N: SWT-000013-01
TP1 TP2 = TP_TH: Test Point, Through Hole Pad 40mil ID

## Sheet TB-S5D5_p05_JLink_OB-S124_QFP-v1.2.SchDoc: Renesas AE-CAP1-S3 Target Board
size Legal; Author: Jorge Amodio; Organization: Serious Integrated, Inc.; Address1: 145 s 79th Street; Address2: Suite 34; Address3: Chandler, AZ 85226; Address4: USA; DocumentNumber: 5; Revision: PCB02; SheetNumber: 5; SheetTotal: 5; CompanyURL: www.seriousintegrated.com; ReleaseDate: 8/12/2016; Version: v1.1; Company Name: Renesas Electronics America; PageSetup: Record=PageOptions|CenterHorizontal=True|CenterVertical=True|PrintScale=1.00|XCorrection=1.00|YCorrection=1.00|PrintKind=1|BorderSize=5000000|LeftOffset=0|BottomOffset=0|Orientation=2|PaperLength=1000|PaperWidth=1000|Scale=100|PaperSource=7|PrintQuality=-4|MediaType=1|DitherType=10|PaperKind=A5 148x210mm|PrintScaleMode=1
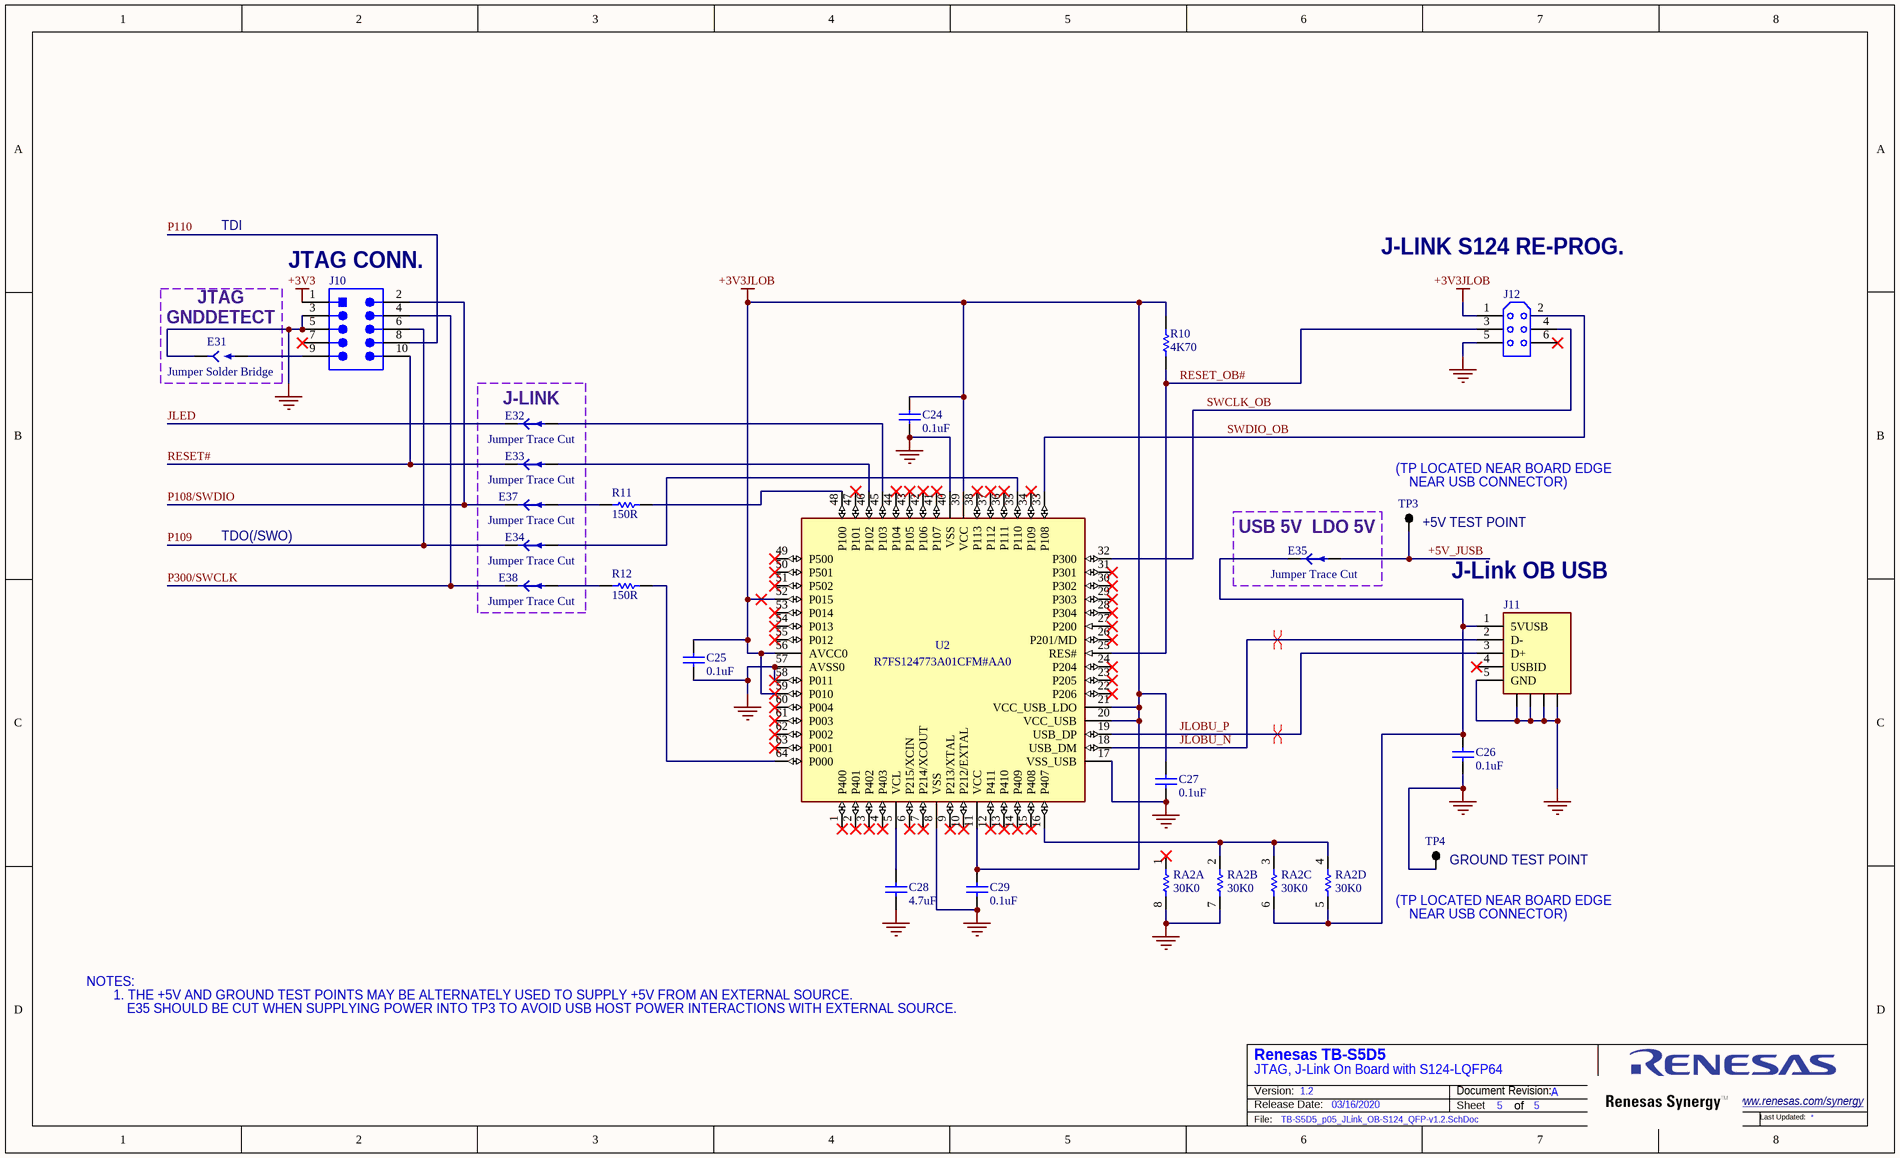
[diagram p4: TB-S5D5_p05_JLink_OB-S124_QFP-v1.2.SchDoc]

### Parts
C24  Capacitance: 0.1uF  [CAPC0603-01]  (hidden comment: CAP-000029-01)
C25  Capacitance: 0.1uF  [CAPC0603-01]  (hidden comment: CAP-000029-01)
C26  Capacitance: 0.1uF  [CAPC0603-01]  (hidden comment: CAP-000029-01)
C27  Capacitance: 0.1uF  [CAPC0603-01]  (hidden comment: CAP-000029-01)
C28  Capacitance: 4.7uF  [CAPC0603-01]  (hidden comment: CAP-000043-01)
C29  Capacitance: 0.1uF  [CAPC0603-01]  (hidden comment: CAP-000029-01)
E31  Jumper Solder Bridge  [E_PadsSplit0805]  (no BOM)
E32  Jumper Trace Cut  [E_PadsTraceCut0805]  (net tie, no BOM)
E33  Jumper Trace Cut  [E_PadsTraceCut0805]  (net tie, no BOM)
E34  Jumper Trace Cut  [E_PadsTraceCut0805]  (net tie, no BOM)
E35  Jumper Trace Cut  [E_PadsTraceCut0805]  (net tie, no BOM)
E37  Jumper Trace Cut  [E_PadsTraceCut0805]  (net tie, no BOM)
E38  Jumper Trace Cut  [E_PadsTraceCut0805]  (net tie, no BOM)
J10  CON-REN001-01  [J_10pTH2cx5r]  (value not drawn)
J11  CON-000116-01  [FCI_10118192]  (value not drawn)
J12  CON-000241-01  [TC2030NL]  (value not drawn)
R10  Resistance: 4K70  [RESC0402-01]  (hidden comment: RES-000127-01)
R11  Resistance: 150R  [RESC0402-01]  (hidden comment: RES-000220-01)
R12  Resistance: 150R  [RESC0402-01]  (hidden comment: RES-000220-01)
RA2  Resistance: 30K0  [RESCAF0804]  (hidden comment: RES-000117-01)  (parts A,B,C,D of 4)
TP3  Test Point  [TP_40milTHpad]  (value not drawn)  (no BOM)
TP4  Test Point  [TP_40milTHpad]  (value not drawn)  (no BOM)
U2  Display Name: R7FS124773A01CFM#AA0  [RENESAS_PLQP0064KB-A_N]  (hidden comment: ICN-000202-01)

### Blocks framed on the sheet
J-LINK: E32-E34 E37 E38
USB 5V  LDO 5V: E35

### Nets
+3V3: J10.1
+3V3JLOB: C24.2 C25.2 C27.2 C29.2 J12.1 R10.2 U2.11(VCC) U2.20(VCC_USB) U2.21(VCC_USB_LDO) U2.39(VCC) U2.52(P015) U2.56(AVCC0) U2.59(P010)
GND: C24.1 C25.1 C26.1 C27.1 C28.2 C29.1 E31.1(A) J10.3 J10.5 J11.5(GND) J11.C1 J11.C2 J11.C3 J11.C4 J12.5 RA2.7 RA2.8 TP4.1(TP) U2.8(VSS) U2.17(VSS_USB) U2.40(VSS) U2.57(AVSS0) U2.58(P011)
+5V_JUSB: E35.2(A) TP3.1(TP)
JLED: E32.1(A)
JLOBU_N: J11.2(D-) U2.18(USB_DM)
JLOBU_P: J11.3(D+) U2.19(USB_DP)
P108/SWDIO: E37.1(A) J10.2
P109: E34.1(A) J10.6
P110: J10.8
P300/SWCLK: E38.1(A) J10.4
RESET#: E33.1(A) J10.10
RESET_OB#: J12.3 R10.1 U2.25(RES#)
SWCLK_OB: J12.4 U2.32(P300)
SWDIO_OB: J12.2 U2.33(P108)
NetC26_2: C26.2 E35.1(A) J11.1(5VUSB) RA2.5 RA2.6
NetC28_1: C28.1 U2.5(VCL)
NetE31_2: E31.2(A) J10.9
NetE32_2: E32.2(A) U2.45(P103)
NetE33_2: E33.2(A) U2.46(P102)
NetE34_2: E34.2(A) U2.35(P110)
NetE37_2: E37.2(A) R11.1
NetE38_2: E38.2(A) R12.1
NetR11_2: R11.2 U2.48(P100)
NetR12_2: R12.2 U2.64(P000)
NetRA2_2: RA2.2 RA2.3 RA2.4 U2.16(P407)

Not connected (* = marked no-connect by the designer): J10 7*; J11 4(USBID)*; J12 6*; RA2 1*; U2 1(P400)* 2(P401)* 3(P402)* 4(P403)* 6(P215/XCIN)* 7(P214/XCOUT)* 9(P213/XTAL)* 10(P212/EXTAL)* 12(P411)* 13(P410)* 14(P409)* 15(P408)* 22(P206)* 23(P205)* 24(P204)* 26(P201/MD)* 27(P200)* 28(P304)* 29(P303)* 30(P302)* 31(P301)* 34(P109)* 36(P111)* 37(P112)* 38(P113)* 41(P107)* 42(P106)* 43(P105)* 44(P104)* 47(P101)* 49(P500)* 50(P501)* 51(P502)* 53(P014)* 54(P013)* 55(P012)* 60(P004)* 61(P003)* 62(P002)* 63(P001)*

### Layout directives
differential pair: JLOBU_N, JLOBU_P

### Notes on the sheet
- TDI
- (near J10) JTAG CONN.
- J-LINK S124 RE-PROG.
- (near E31) JTAG
- (near E31) GNDDETECT
- (near TP3) (TP LOCATED NEAR BOARD EDGE
- (near TP3) NEAR USB CONNECTOR)
- TDO(/SWO)
- (near TP3) +5V TEST POINT
- J-Link OB USB
- (near TP4) (TP LOCATED NEAR BOARD EDGE
- (near TP4) GROUND TEST POINT
- (near TP4) NEAR USB CONNECTOR)
- NOTES:
- 1. THE +5V AND GROUND TEST POINTS MAY BE ALTERNATELY USED TO SUPPLY +5V FROM AN EXTERNAL SOURCE.
- E35 SHOULD BE CUT WHEN SUPPLYING POWER INTO TP3 TO AVOID USB HOST POWER INTERACTIONS WITH EXTERNAL SOURCE.
- JTAG, J-Link On Board with S124-LQFP64
- Version:
- Release Date:
- Document Revision:
- Sheet
- of
- www.renesas.com/synergy <http://www.renesas.com/synergy>
- File:
- 60
- Last Updated:

### Library data of the parts
C24-C27 C29 = CAP-000029-01: as C1 on sheet TB-S5D5_p02_Power-v1.2; Voltage: 50V; Package: 0603
C28 = CAP-000043-01: as C4 on sheet TB-S5D5_p03_MCU-v1.2; Voltage: 6.3V; Package: 0603
E31 = E_JmpSldrBridge: as E5 on sheet TB-S5D5_p02_Power-v1.2
E32-E35 E37 E38 = E_JmpTraceCut: as E1 on sheet TB-S5D5_p02_Power-v1.2
J10 = CON-REN001-01: 10 Position Shrouded Header 1.27mm Pitch; Manufacturer: CNC Tech; Mfg Part Number: 3220-10-0100-00; Positions: 10; Pitch: 1.27mm
J11 = CON-000116-01: as J9 on sheet TB-S5D5_p04_Connectors-v1.2
J12 = CON-000241-01: Tag Connect TC-2030 PCB Pads 6 Pos 2x3
R10 = RES-000127-01: Chip Resistor Thick Film 0402 4K70 0.5% 1/16W; Manufacturer: Panasonic; Mfg Part Number: ERA-2AED472X; Package: 0402; Power: 1/16W; Tolerance: 0.5%
R11 R12 = RES-000220-01: Chip Resistor Thick Film 0402 150R 1% 1/10W; Manufacturer: Panasonic; Mfg Part Number: ERJ-2RKF1500X; Package: 0402; Power: 1/10W; Tolerance: 1%
RA2 = RES-000117-01: as RA1 on sheet TB-S5D5_p04_Connectors-v1.2; Package: 0804; Power: 1/16W; Tolerance: 5%
TP3 TP4 = TP_TH: Test Point, Through Hole Pad 40mil ID
U2 = ICN-000202-01: Renesas S124 32-Bit 32MHz Cortex M0+ MCU LQFP64; Architecture: 32bits; CAN: 1; Ethernet: 0; FLASH E2ROM: TBD; FLASH ROM: TBD; Manufacturer: Renesas; Max Clock Speed: 32MHz; Mfg Part Number: R7FS124773A01CFM#AA0; Package: LQFP-64; RAM: TBD

## Nets that join several sheets
+3V3: TB-S5D5_p02_Power-v1.2 (5 pins), TB-S5D5_p03_MCU-v1.2 (E6.1 E6.2), TB-S5D5_p04_Connectors-v1.2 (6 pins), TB-S5D5_p05_JLink_OB-S124_QFP-v1.2 (J10.1)
+3V3JLOB: TB-S5D5_p02_Power-v1.2 (E1.2), TB-S5D5_p05_JLink_OB-S124_QFP-v1.2 (13 pins)
+3V3MCU: TB-S5D5_p02_Power-v1.2 (R3.2), TB-S5D5_p03_MCU-v1.2 (23 pins), TB-S5D5_p04_Connectors-v1.2 (J1.15 J2.10 J4.37 R8.2)
GND: TB-S5D5_p02_Power-v1.2 (12 pins), TB-S5D5_p03_MCU-v1.2 (31 pins), TB-S5D5_p04_Connectors-v1.2 (22 pins), TB-S5D5_p05_JLink_OB-S124_QFP-v1.2 (23 pins)
+5V_JUSB: TB-S5D5_p02_Power-v1.2 (D1.A), TB-S5D5_p05_JLink_OB-S124_QFP-v1.2 (E35.2 TP3.1)
AVCC0: TB-S5D5_p03_MCU-v1.2 (C8.1 E10.1 U1.127), TB-S5D5_p04_Connectors-v1.2 (J2.38)
AVSS0: TB-S5D5_p03_MCU-v1.2 (C8.2 E11.2 U1.128), TB-S5D5_p04_Connectors-v1.2 (J2.36)
JLED: TB-S5D5_p02_Power-v1.2 (R2.1), TB-S5D5_p05_JLink_OB-S124_QFP-v1.2 (E32.1)
P000: TB-S5D5_p03_MCU-v1.2 (U1.140), TB-S5D5_p04_Connectors-v1.2 (J2.30)
P001: TB-S5D5_p03_MCU-v1.2 (U1.139), TB-S5D5_p04_Connectors-v1.2 (J2.28)
P002: TB-S5D5_p03_MCU-v1.2 (U1.138), TB-S5D5_p04_Connectors-v1.2 (J4.17)
P003: TB-S5D5_p03_MCU-v1.2 (U1.137), TB-S5D5_p04_Connectors-v1.2 (J2.26)
P004: TB-S5D5_p02_Power-v1.2 (E36.1), TB-S5D5_p03_MCU-v1.2 (U1.136), TB-S5D5_p04_Connectors-v1.2 (J2.24)
P005: TB-S5D5_p03_MCU-v1.2 (U1.135), TB-S5D5_p04_Connectors-v1.2 (J4.19)
P006: TB-S5D5_p03_MCU-v1.2 (U1.134), TB-S5D5_p04_Connectors-v1.2 (J4.21)
P007: TB-S5D5_p03_MCU-v1.2 (U1.133), TB-S5D5_p04_Connectors-v1.2 (J4.23)
P008: TB-S5D5_p03_MCU-v1.2 (U1.132), TB-S5D5_p04_Connectors-v1.2 (J4.25)
P009: TB-S5D5_p03_MCU-v1.2 (U1.131), TB-S5D5_p04_Connectors-v1.2 (J4.26)
P014: TB-S5D5_p03_MCU-v1.2 (U1.124), TB-S5D5_p04_Connectors-v1.2 (J2.40)
P015: TB-S5D5_p03_MCU-v1.2 (U1.123), TB-S5D5_p04_Connectors-v1.2 (J1.39)
P100: TB-S5D5_p03_MCU-v1.2 (U1.108), TB-S5D5_p04_Connectors-v1.2 (J1.1 J5.3)
P101: TB-S5D5_p03_MCU-v1.2 (U1.107), TB-S5D5_p04_Connectors-v1.2 (J2.4 J5.2)
P102: TB-S5D5_p03_MCU-v1.2 (U1.106), TB-S5D5_p04_Connectors-v1.2 (J2.6 J5.4)
P103: TB-S5D5_p03_MCU-v1.2 (U1.105), TB-S5D5_p04_Connectors-v1.2 (J1.29 J5.1)
P104: TB-S5D5_p03_MCU-v1.2 (U1.104), TB-S5D5_p04_Connectors-v1.2 (J3.39 J5.7)
P105: TB-S5D5_p02_Power-v1.2 (E4.1), TB-S5D5_p03_MCU-v1.2 (U1.103), TB-S5D5_p04_Connectors-v1.2 (J1.37)
P106: TB-S5D5_p02_Power-v1.2 (E3.1), TB-S5D5_p03_MCU-v1.2 (U1.102), TB-S5D5_p04_Connectors-v1.2 (J3.38)
P107: TB-S5D5_p03_MCU-v1.2 (U1.101), TB-S5D5_p04_Connectors-v1.2 (J3.37 J5.8)
P108/SWDIO: TB-S5D5_p03_MCU-v1.2 (U1.73), TB-S5D5_p04_Connectors-v1.2 (J1.13), TB-S5D5_p05_JLink_OB-S124_QFP-v1.2 (E37.1 J10.2)
P109: TB-S5D5_p03_MCU-v1.2 (U1.74), TB-S5D5_p04_Connectors-v1.2 (J1.7), TB-S5D5_p05_JLink_OB-S124_QFP-v1.2 (E34.1 J10.6)
P110: TB-S5D5_p03_MCU-v1.2 (U1.75), TB-S5D5_p04_Connectors-v1.2 (J1.9), TB-S5D5_p05_JLink_OB-S124_QFP-v1.2 (J10.8)
P111: TB-S5D5_p03_MCU-v1.2 (U1.76), TB-S5D5_p04_Connectors-v1.2 (J1.33 J5.9)
P112: TB-S5D5_p03_MCU-v1.2 (U1.77), TB-S5D5_p04_Connectors-v1.2 (J3.15 J5.10)
P113: TB-S5D5_p03_MCU-v1.2 (U1.78), TB-S5D5_p04_Connectors-v1.2 (J3.16)
P114: TB-S5D5_p03_MCU-v1.2 (U1.79), TB-S5D5_p04_Connectors-v1.2 (J3.17)
P115: TB-S5D5_p03_MCU-v1.2 (U1.80), TB-S5D5_p04_Connectors-v1.2 (J3.18)
P200/NMI: TB-S5D5_p03_MCU-v1.2 (R7.1 U1.57), TB-S5D5_p04_Connectors-v1.2 (J1.38)
P201/MD: TB-S5D5_p03_MCU-v1.2 (U1.56), TB-S5D5_p04_Connectors-v1.2 (J1.36 J8.1)
P202: TB-S5D5_p03_MCU-v1.2 (U1.46), TB-S5D5_p04_Connectors-v1.2 (J1.12)
P203: TB-S5D5_p03_MCU-v1.2 (U1.45), TB-S5D5_p04_Connectors-v1.2 (J1.10)
P204: TB-S5D5_p03_MCU-v1.2 (U1.44), TB-S5D5_p04_Connectors-v1.2 (J1.5)
P205: TB-S5D5_p03_MCU-v1.2 (E12.2), TB-S5D5_p04_Connectors-v1.2 (J2.14)
P206: TB-S5D5_p03_MCU-v1.2 (U1.42), TB-S5D5_p04_Connectors-v1.2 (J1.3)
P207: TB-S5D5_p02_Power-v1.2 (E2.1 E5.1), TB-S5D5_p03_MCU-v1.2 (U1.41)
P207J: TB-S5D5_p02_Power-v1.2 (E5.2), TB-S5D5_p04_Connectors-v1.2 (J1.8)
P208: TB-S5D5_p03_MCU-v1.2 (U1.54), TB-S5D5_p04_Connectors-v1.2 (J1.32)
P209: TB-S5D5_p03_MCU-v1.2 (U1.53), TB-S5D5_p04_Connectors-v1.2 (J1.30)
P210: TB-S5D5_p03_MCU-v1.2 (U1.52), TB-S5D5_p04_Connectors-v1.2 (J1.28)
P211: TB-S5D5_p03_MCU-v1.2 (U1.51), TB-S5D5_p04_Connectors-v1.2 (J1.22)
P212: TB-S5D5_p03_MCU-v1.2 (E19.1), TB-S5D5_p04_Connectors-v1.2 (J2.19)
P213: TB-S5D5_p03_MCU-v1.2 (E18.1), TB-S5D5_p04_Connectors-v1.2 (J2.21)
P214: TB-S5D5_p03_MCU-v1.2 (U1.50), TB-S5D5_p04_Connectors-v1.2 (J1.20)
P300/SWCLK: TB-S5D5_p03_MCU-v1.2 (U1.72), TB-S5D5_p04_Connectors-v1.2 (J1.31), TB-S5D5_p05_JLink_OB-S124_QFP-v1.2 (E38.1 J10.4)
P301: TB-S5D5_p03_MCU-v1.2 (U1.71), TB-S5D5_p04_Connectors-v1.2 (J1.11)
P302: TB-S5D5_p03_MCU-v1.2 (U1.70), TB-S5D5_p04_Connectors-v1.2 (J3.14)
P303: TB-S5D5_p03_MCU-v1.2 (U1.69), TB-S5D5_p04_Connectors-v1.2 (J3.13)
P304: TB-S5D5_p03_MCU-v1.2 (U1.66), TB-S5D5_p04_Connectors-v1.2 (J3.12)
P305: TB-S5D5_p03_MCU-v1.2 (U1.65), TB-S5D5_p04_Connectors-v1.2 (J3.11)
P306: TB-S5D5_p03_MCU-v1.2 (U1.64), TB-S5D5_p04_Connectors-v1.2 (J3.10)
P307: TB-S5D5_p03_MCU-v1.2 (U1.63), TB-S5D5_p04_Connectors-v1.2 (J3.9)
P308: TB-S5D5_p03_MCU-v1.2 (U1.62), TB-S5D5_p04_Connectors-v1.2 (J3.8)
P309: TB-S5D5_p03_MCU-v1.2 (U1.61), TB-S5D5_p04_Connectors-v1.2 (J3.7)
P310: TB-S5D5_p03_MCU-v1.2 (U1.60), TB-S5D5_p04_Connectors-v1.2 (J3.6)
P311: TB-S5D5_p03_MCU-v1.2 (U1.59), TB-S5D5_p04_Connectors-v1.2 (J3.5)
P312: TB-S5D5_p03_MCU-v1.2 (U1.58), TB-S5D5_p04_Connectors-v1.2 (J3.4)
P313: TB-S5D5_p03_MCU-v1.2 (U1.47), TB-S5D5_p04_Connectors-v1.2 (J1.14)
P400: TB-S5D5_p03_MCU-v1.2 (U1.1), TB-S5D5_p04_Connectors-v1.2 (J4.13 J6.4)
P401: TB-S5D5_p03_MCU-v1.2 (U1.2), TB-S5D5_p04_Connectors-v1.2 (J4.11 J6.2)
P402: TB-S5D5_p03_MCU-v1.2 (U1.3), TB-S5D5_p04_Connectors-v1.2 (J1.27 J6.3)
P403: TB-S5D5_p03_MCU-v1.2 (U1.4), TB-S5D5_p04_Connectors-v1.2 (J4.2 J6.1)
P404: TB-S5D5_p03_MCU-v1.2 (U1.5), TB-S5D5_p04_Connectors-v1.2 (J4.4)
P405: TB-S5D5_p03_MCU-v1.2 (U1.6), TB-S5D5_p04_Connectors-v1.2 (J4.6)
P406: TB-S5D5_p03_MCU-v1.2 (U1.7), TB-S5D5_p04_Connectors-v1.2 (J4.8)
P407/USB_VBUS: TB-S5D5_p03_MCU-v1.2 (U1.36), TB-S5D5_p04_Connectors-v1.2 (E30.1 J2.22)
P408: TB-S5D5_p03_MCU-v1.2 (U1.35), TB-S5D5_p04_Connectors-v1.2 (J2.16)
P409: TB-S5D5_p03_MCU-v1.2 (U1.34), TB-S5D5_p04_Connectors-v1.2 (J2.18)
P410: TB-S5D5_p03_MCU-v1.2 (U1.33), TB-S5D5_p04_Connectors-v1.2 (J2.2)
P411: TB-S5D5_p03_MCU-v1.2 (U1.32), TB-S5D5_p04_Connectors-v1.2 (J2.20)
P412: TB-S5D5_p03_MCU-v1.2 (U1.31), TB-S5D5_p04_Connectors-v1.2 (J2.1)
P413: TB-S5D5_p03_MCU-v1.2 (U1.30), TB-S5D5_p04_Connectors-v1.2 (J2.8)
P414: TB-S5D5_p03_MCU-v1.2 (U1.29), TB-S5D5_p04_Connectors-v1.2 (J2.3)
P415: TB-S5D5_p03_MCU-v1.2 (U1.28), TB-S5D5_p04_Connectors-v1.2 (J2.5)
P500: TB-S5D5_p03_MCU-v1.2 (U1.113), TB-S5D5_p04_Connectors-v1.2 (J4.20)
P501: TB-S5D5_p03_MCU-v1.2 (U1.114), TB-S5D5_p04_Connectors-v1.2 (J4.18)
P502: TB-S5D5_p03_MCU-v1.2 (U1.115), TB-S5D5_p04_Connectors-v1.2 (J4.16)
P503: TB-S5D5_p03_MCU-v1.2 (U1.116), TB-S5D5_p04_Connectors-v1.2 (J4.14)
P504: TB-S5D5_p03_MCU-v1.2 (U1.117), TB-S5D5_p04_Connectors-v1.2 (J4.12)
P505: TB-S5D5_p03_MCU-v1.2 (U1.118), TB-S5D5_p04_Connectors-v1.2 (J4.10)
P506: TB-S5D5_p03_MCU-v1.2 (U1.119), TB-S5D5_p04_Connectors-v1.2 (J4.22)
P508: TB-S5D5_p03_MCU-v1.2 (U1.120), TB-S5D5_p04_Connectors-v1.2 (J4.24)
P511: TB-S5D5_p03_MCU-v1.2 (U1.144), TB-S5D5_p04_Connectors-v1.2 (J1.35)
P512: TB-S5D5_p03_MCU-v1.2 (U1.143), TB-S5D5_p04_Connectors-v1.2 (J4.15)
P600: TB-S5D5_p03_MCU-v1.2 (U1.98), TB-S5D5_p04_Connectors-v1.2 (J1.23)
P601: TB-S5D5_p03_MCU-v1.2 (U1.97), TB-S5D5_p04_Connectors-v1.2 (J1.19)
P602: TB-S5D5_p03_MCU-v1.2 (U1.96), TB-S5D5_p04_Connectors-v1.2 (J1.21)
P603: TB-S5D5_p03_MCU-v1.2 (U1.95), TB-S5D5_p04_Connectors-v1.2 (J1.25)
P604: TB-S5D5_p03_MCU-v1.2 (U1.94), TB-S5D5_p04_Connectors-v1.2 (J3.36)
P605: TB-S5D5_p03_MCU-v1.2 (U1.93), TB-S5D5_p04_Connectors-v1.2 (J3.35)
P608: TB-S5D5_p03_MCU-v1.2 (U1.83), TB-S5D5_p04_Connectors-v1.2 (J3.19)
P609: TB-S5D5_p03_MCU-v1.2 (U1.84), TB-S5D5_p04_Connectors-v1.2 (J3.20)
P610: TB-S5D5_p03_MCU-v1.2 (U1.85), TB-S5D5_p04_Connectors-v1.2 (J3.21)
P611: TB-S5D5_p03_MCU-v1.2 (U1.86), TB-S5D5_p04_Connectors-v1.2 (J3.22)
P612: TB-S5D5_p03_MCU-v1.2 (U1.87), TB-S5D5_p04_Connectors-v1.2 (J3.23)
P613: TB-S5D5_p03_MCU-v1.2 (U1.88), TB-S5D5_p04_Connectors-v1.2 (J3.24)
P614: TB-S5D5_p03_MCU-v1.2 (U1.89), TB-S5D5_p04_Connectors-v1.2 (J3.25)
P700: TB-S5D5_p03_MCU-v1.2 (U1.8), TB-S5D5_p04_Connectors-v1.2 (J4.9)
P701: TB-S5D5_p03_MCU-v1.2 (U1.9), TB-S5D5_p04_Connectors-v1.2 (J4.7)
P702: TB-S5D5_p03_MCU-v1.2 (U1.10), TB-S5D5_p04_Connectors-v1.2 (J4.5)
P703: TB-S5D5_p03_MCU-v1.2 (U1.11), TB-S5D5_p04_Connectors-v1.2 (J4.3)
P704: TB-S5D5_p03_MCU-v1.2 (U1.12), TB-S5D5_p04_Connectors-v1.2 (J4.1)
P705: TB-S5D5_p03_MCU-v1.2 (U1.13), TB-S5D5_p04_Connectors-v1.2 (J2.39)
P708: TB-S5D5_p03_MCU-v1.2 (U1.27), TB-S5D5_p04_Connectors-v1.2 (J2.7)
P709: TB-S5D5_p03_MCU-v1.2 (U1.26), TB-S5D5_p04_Connectors-v1.2 (J2.11)
P710: TB-S5D5_p03_MCU-v1.2 (U1.25), TB-S5D5_p04_Connectors-v1.2 (J2.13)
P711: TB-S5D5_p03_MCU-v1.2 (U1.24), TB-S5D5_p04_Connectors-v1.2 (J2.15)
P712: TB-S5D5_p03_MCU-v1.2 (U1.23), TB-S5D5_p04_Connectors-v1.2 (J2.31)
P713: TB-S5D5_p03_MCU-v1.2 (U1.22), TB-S5D5_p04_Connectors-v1.2 (J2.33)
P800: TB-S5D5_p03_MCU-v1.2 (U1.109), TB-S5D5_p04_Connectors-v1.2 (J4.30)
P801: TB-S5D5_p03_MCU-v1.2 (U1.110), TB-S5D5_p04_Connectors-v1.2 (J4.29)
RESET#: TB-S5D5_p03_MCU-v1.2 (R6.1 U1.55), TB-S5D5_p04_Connectors-v1.2 (J1.34 S2.3 S2.4), TB-S5D5_p05_JLink_OB-S124_QFP-v1.2 (E33.1 J10.10)
USB_N: TB-S5D5_p03_MCU-v1.2 (E16.1), TB-S5D5_p04_Connectors-v1.2 (FL1.1)
USB_P: TB-S5D5_p03_MCU-v1.2 (E17.1), TB-S5D5_p04_Connectors-v1.2 (FL1.4)
USBPH_N: TB-S5D5_p03_MCU-v1.2 (E21.2), TB-S5D5_p04_Connectors-v1.2 (J1.2)
USBPH_P: TB-S5D5_p03_MCU-v1.2 (E20.2), TB-S5D5_p04_Connectors-v1.2 (J1.4)
VBAT: TB-S5D5_p03_MCU-v1.2 (C5.1 E6.4 U1.14), TB-S5D5_p04_Connectors-v1.2 (J2.29)
VCC_USB: TB-S5D5_p03_MCU-v1.2 (E14.2), TB-S5D5_p04_Connectors-v1.2 (J1.6)
VCL: TB-S5D5_p03_MCU-v1.2 (E55.2), TB-S5D5_p04_Connectors-v1.2 (J3.30)
VCL0: TB-S5D5_p03_MCU-v1.2 (E28.1), TB-S5D5_p04_Connectors-v1.2 (J2.27)
VREFH: TB-S5D5_p03_MCU-v1.2 (E52.1 U1.126), TB-S5D5_p04_Connectors-v1.2 (C23.2 J4.27)
VREFH0: TB-S5D5_p03_MCU-v1.2 (E50.1 U1.130), TB-S5D5_p04_Connectors-v1.2 (C21.2 J2.32)
VREFL: TB-S5D5_p03_MCU-v1.2 (E53.2 U1.125), TB-S5D5_p04_Connectors-v1.2 (C23.1 J4.28)
VREFL0: TB-S5D5_p03_MCU-v1.2 (E51.2 U1.129), TB-S5D5_p04_Connectors-v1.2 (C21.1 J2.34)
XCIN: TB-S5D5_p03_MCU-v1.2 (E22.1), TB-S5D5_p04_Connectors-v1.2 (J2.25)

## Assembly variants
PR: not fitted C30 C33 J12 POT1
MP: not fitted C30 C33 J12 POT1